# Altium project Main_PCB.PrjPcb
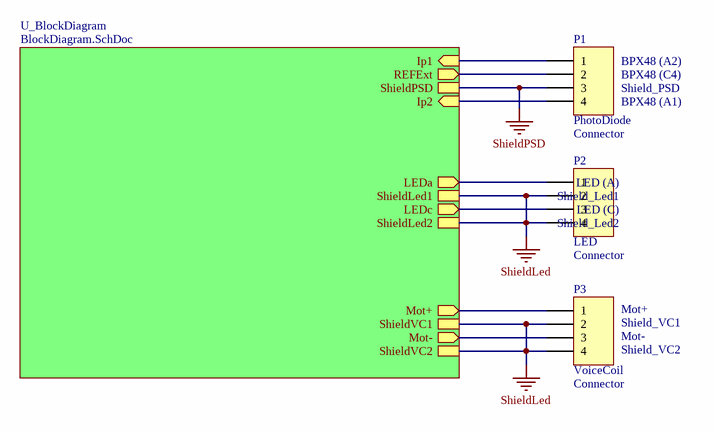
[diagram p0: Main_PCB.SchDoc]
ProjectVersionForDoc: 1_0_0; ProjectVersion: 1.0.0; ProjectNumber: N° SGX; ProjectiAiTitle: Balance; ProjectAuthor: BKO + PKI
8 sheets, 240 parts. Net scope: hierarchical (ports join the sheet entries above them; power ports are global).
Board file: iAi_TemplateProject_4L.PcbDoc
Sheets:
  Main_PCB.SchDoc
    U_BlockDiagram = BlockDiagram.SchDoc
      U_BlockPowerSupply = BlockPowerSupply.SchDoc
      U_BlockAmpli_LED = BlockAmpli_LED.SchDoc
      U_BlockAmpli_Mot = BlockAmpli_Mot.SchDoc
      U_BlockMesIp = BlockMesIp.SchDoc
      U_BlockUIAffichage = BlockUIAffichage.SchDoc
      U_BlockController = BlockController.SchDoc

## Sheet Main_PCB.SchDoc: Main_PCB
size A4; Author: BKO + PKI; Organization: Institut d'Automatisation Industrielle; SheetNumber: 1; SheetTotal: 8; SVN: OUI; Version: 1.0.0; NoProject: N° SGX; ProjectTitle: Balance; CurrentTime: 6; CurrentDate: 5; DocumentFullPathAndName: 8; DocumentName: 9; ModifiedDate: 13; ProjectName: <projet>

### Parts
P1  PhotoDiode  System: Connector  [HDR1X4]
P2  LED  System: Connector  [HDR1X4]
P3  VoiceCoil  System: Connector  [HDR1X4]

### Sub-sheets
U_BlockDiagram = BlockDiagram.SchDoc: Ip1 (in), REFExt (out), LEDa (out), LEDc (out), Mot+ (out), Mot- (out), ShieldPSD, Ip2 (in), ShieldLed1, ShieldLed2, ShieldVC1, ShieldVC2

### Nets
ShieldLed: P1.3 P2.2 P2.4 P3.2 P3.4 ; sheet U_BlockDiagram/ShieldPSD, sheet U_BlockDiagram/ShieldLed1, sheet U_BlockDiagram/ShieldLed2, sheet U_BlockDiagram/ShieldVC1, sheet U_BlockDiagram/ShieldVC2  [also labelled ShieldPSD]  [project net Shield]
NetP1_1: P1.1 ; sheet U_BlockDiagram/Ip1
NetP1_2: P1.2 ; sheet U_BlockDiagram/REFExt
NetP1_4: P1.4 ; sheet U_BlockDiagram/Ip2
NetP2_1: P2.1 ; sheet U_BlockDiagram/LEDa
NetP2_3: P2.3 ; sheet U_BlockDiagram/LEDc
NetP3_1: P3.1 ; sheet U_BlockDiagram/Mot+
NetP3_3: P3.3 ; sheet U_BlockDiagram/Mot-

### Notes on the sheet
- (near P1) BPX48 (A2)
- (near P1) BPX48 (C4)
- (near P1) Shield_PSD
- (near P1) BPX48 (A1)
- (near P2) LED (C)
- (near P2) Shield_Led1
- (near P2) LED (A)
- (near P2) Shield_Led2
- (near P3) Mot+
- (near P3) Mot-
- (near P3) Shield_VC1
- (near P3) Shield_VC2
- Title
- Institut d'automatisation industrielle
  rte de Cheseaux 1
  CH-1401 Yverdon-les-Bains
  T +41(0)24 55 77 377    F +41(0)24 55 76 320
  http://iai.heig-vd.ch       iai@heig-vd.ch
- Date:
- Size:
- A4
- Project:
- Sheet
- of
- No.
- Author:
- SVN
- Version
- File:

### Library data of the parts
P1-P3 = Header 4: LatestRevisionDate: 17-Jul-2002; LatestRevisionNote: Re-released for DXP Platform.; Publisher: Altium Limited

## Sheet BlockDiagram.SchDoc: <title>
size A4; Author: BKO + PKI; Organization: Institut d'Automatisation Industrielle; SheetNumber: 2; SheetTotal: 8; SVN: OUI; Version: 1.0.0; NoProject: N° SGX; ProjectTitle: Balance; CurrentTime: 6; CurrentDate: 5; DocumentFullPathAndName: 8; DocumentName: 9; ModifiedDate: 13; ProjectName: <projet>
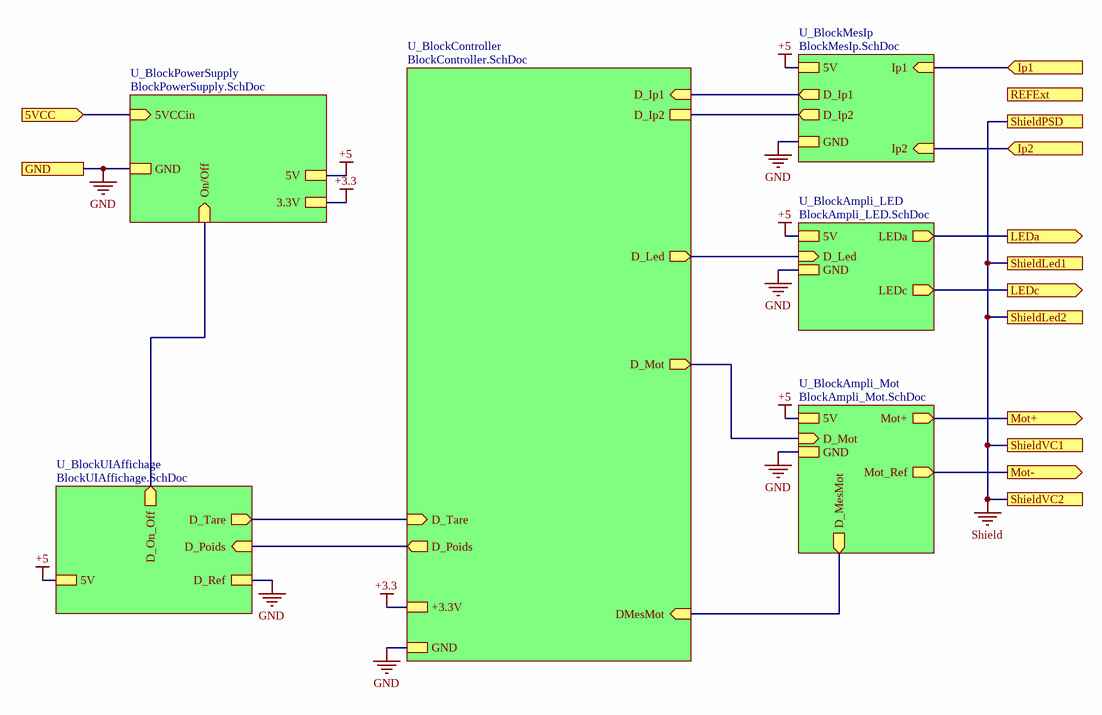
[diagram p1: BlockDiagram.SchDoc]

### Sub-sheets
U_BlockAmpli_LED = BlockAmpli_LED.SchDoc: LEDa (out), LEDc (out), D_Led (in), GND, 5V
U_BlockAmpli_Mot = BlockAmpli_Mot.SchDoc: Mot+ (out), Mot_Ref (out), D_Mot (in), GND, 5V, D_MesMot (out)
U_BlockController = BlockController.SchDoc: D_Ip1 (in), D_Ip2, D_Led (out), D_Mot (out), DMesMot (in), D_Tare (in), GND, +3.3V, D_Poids (out)
U_BlockMesIp = BlockMesIp.SchDoc: Ip1 (in), Ip2 (in), D_Ip1 (out), D_Ip2 (out), GND, 5V
U_BlockPowerSupply = BlockPowerSupply.SchDoc: 5V, GND, 5VCCin (in), On/Off (in), 3.3V
U_BlockUIAffichage = BlockUIAffichage.SchDoc: D_Ref, D_Tare (out), D_On_Off (out), 5V, D_Poids (in)

### Ports
5VCC (in), GND, Ip1 (in), Ip2 (in), LEDa (out), LEDc (out), Mot+ (out), Mot- (out), REFExt (out), ShieldLed1, ShieldLed2, ShieldPSD, ShieldVC1, ShieldVC2

### Nets
+3.3: sheet U_BlockPowerSupply/3.3V, sheet U_BlockController/+3.3V
+5: sheet U_BlockPowerSupply/5V, sheet U_BlockAmpli_LED/5V, sheet U_BlockAmpli_Mot/5V, sheet U_BlockMesIp/5V, sheet U_BlockUIAffichage/5V
GND: port GND, sheet U_BlockPowerSupply/GND, sheet U_BlockAmpli_LED/GND, sheet U_BlockAmpli_Mot/GND, sheet U_BlockMesIp/GND, sheet U_BlockUIAffichage/D_Ref, sheet U_BlockController/GND
Shield: port ShieldPSD, port ShieldLed1, port ShieldLed2, port ShieldVC1, port ShieldVC2
NetP1_1: port Ip1, sheet U_BlockMesIp/Ip1
NetP1_4: port Ip2, sheet U_BlockMesIp/Ip2
NetP2_1: port LEDa, sheet U_BlockAmpli_LED/LEDa
NetP2_3: port LEDc, sheet U_BlockAmpli_LED/LEDc
NetP3_1: port Mot+, sheet U_BlockAmpli_Mot/Mot+
NetP3_3: port Mot-, sheet U_BlockAmpli_Mot/Mot_Ref
(unnamed): port 5VCC, sheet U_BlockPowerSupply/5VCCin
(unnamed): sheet U_BlockPowerSupply/On/Off, sheet U_BlockUIAffichage/D_On_Off
(unnamed): sheet U_BlockAmpli_LED/D_Led, sheet U_BlockController/D_Led
(unnamed): sheet U_BlockAmpli_Mot/D_Mot, sheet U_BlockController/D_Mot
(unnamed): sheet U_BlockAmpli_Mot/D_MesMot, sheet U_BlockController/DMesMot
(unnamed): sheet U_BlockMesIp/D_Ip1, sheet U_BlockController/D_Ip1
(unnamed): sheet U_BlockMesIp/D_Ip2, sheet U_BlockController/D_Ip2
(unnamed): sheet U_BlockUIAffichage/D_Tare, sheet U_BlockController/D_Tare
(unnamed): sheet U_BlockUIAffichage/D_Poids, sheet U_BlockController/D_Poids

### Notes on the sheet
- Title
- Institut d'automatisation industrielle
  rte de Cheseaux 1
  CH-1401 Yverdon-les-Bains
  T +41(0)24 55 77 377    F +41(0)24 55 76 320
  http://iai.heig-vd.ch       iai@heig-vd.ch
- Date:
- Size:
- A4
- Project:
- Sheet
- of
- No.
- Author:
- SVN
- Version
- File:

## Sheet BlockPowerSupply.SchDoc: Block_PowerSupply
size A3; Author: BKO + PKI; Organization: Institut d'Automatisation Industrielle; SheetNumber: 3; SheetTotal: 8; SVN: OUI; Version: 1.0.0; NoProject: N° SGX; ProjectTitle: Balance; CurrentTime: 6; CurrentDate: 5; DocumentFullPathAndName: 8; DocumentName: 9; ModifiedDate: 13; ProjectName: <projet>
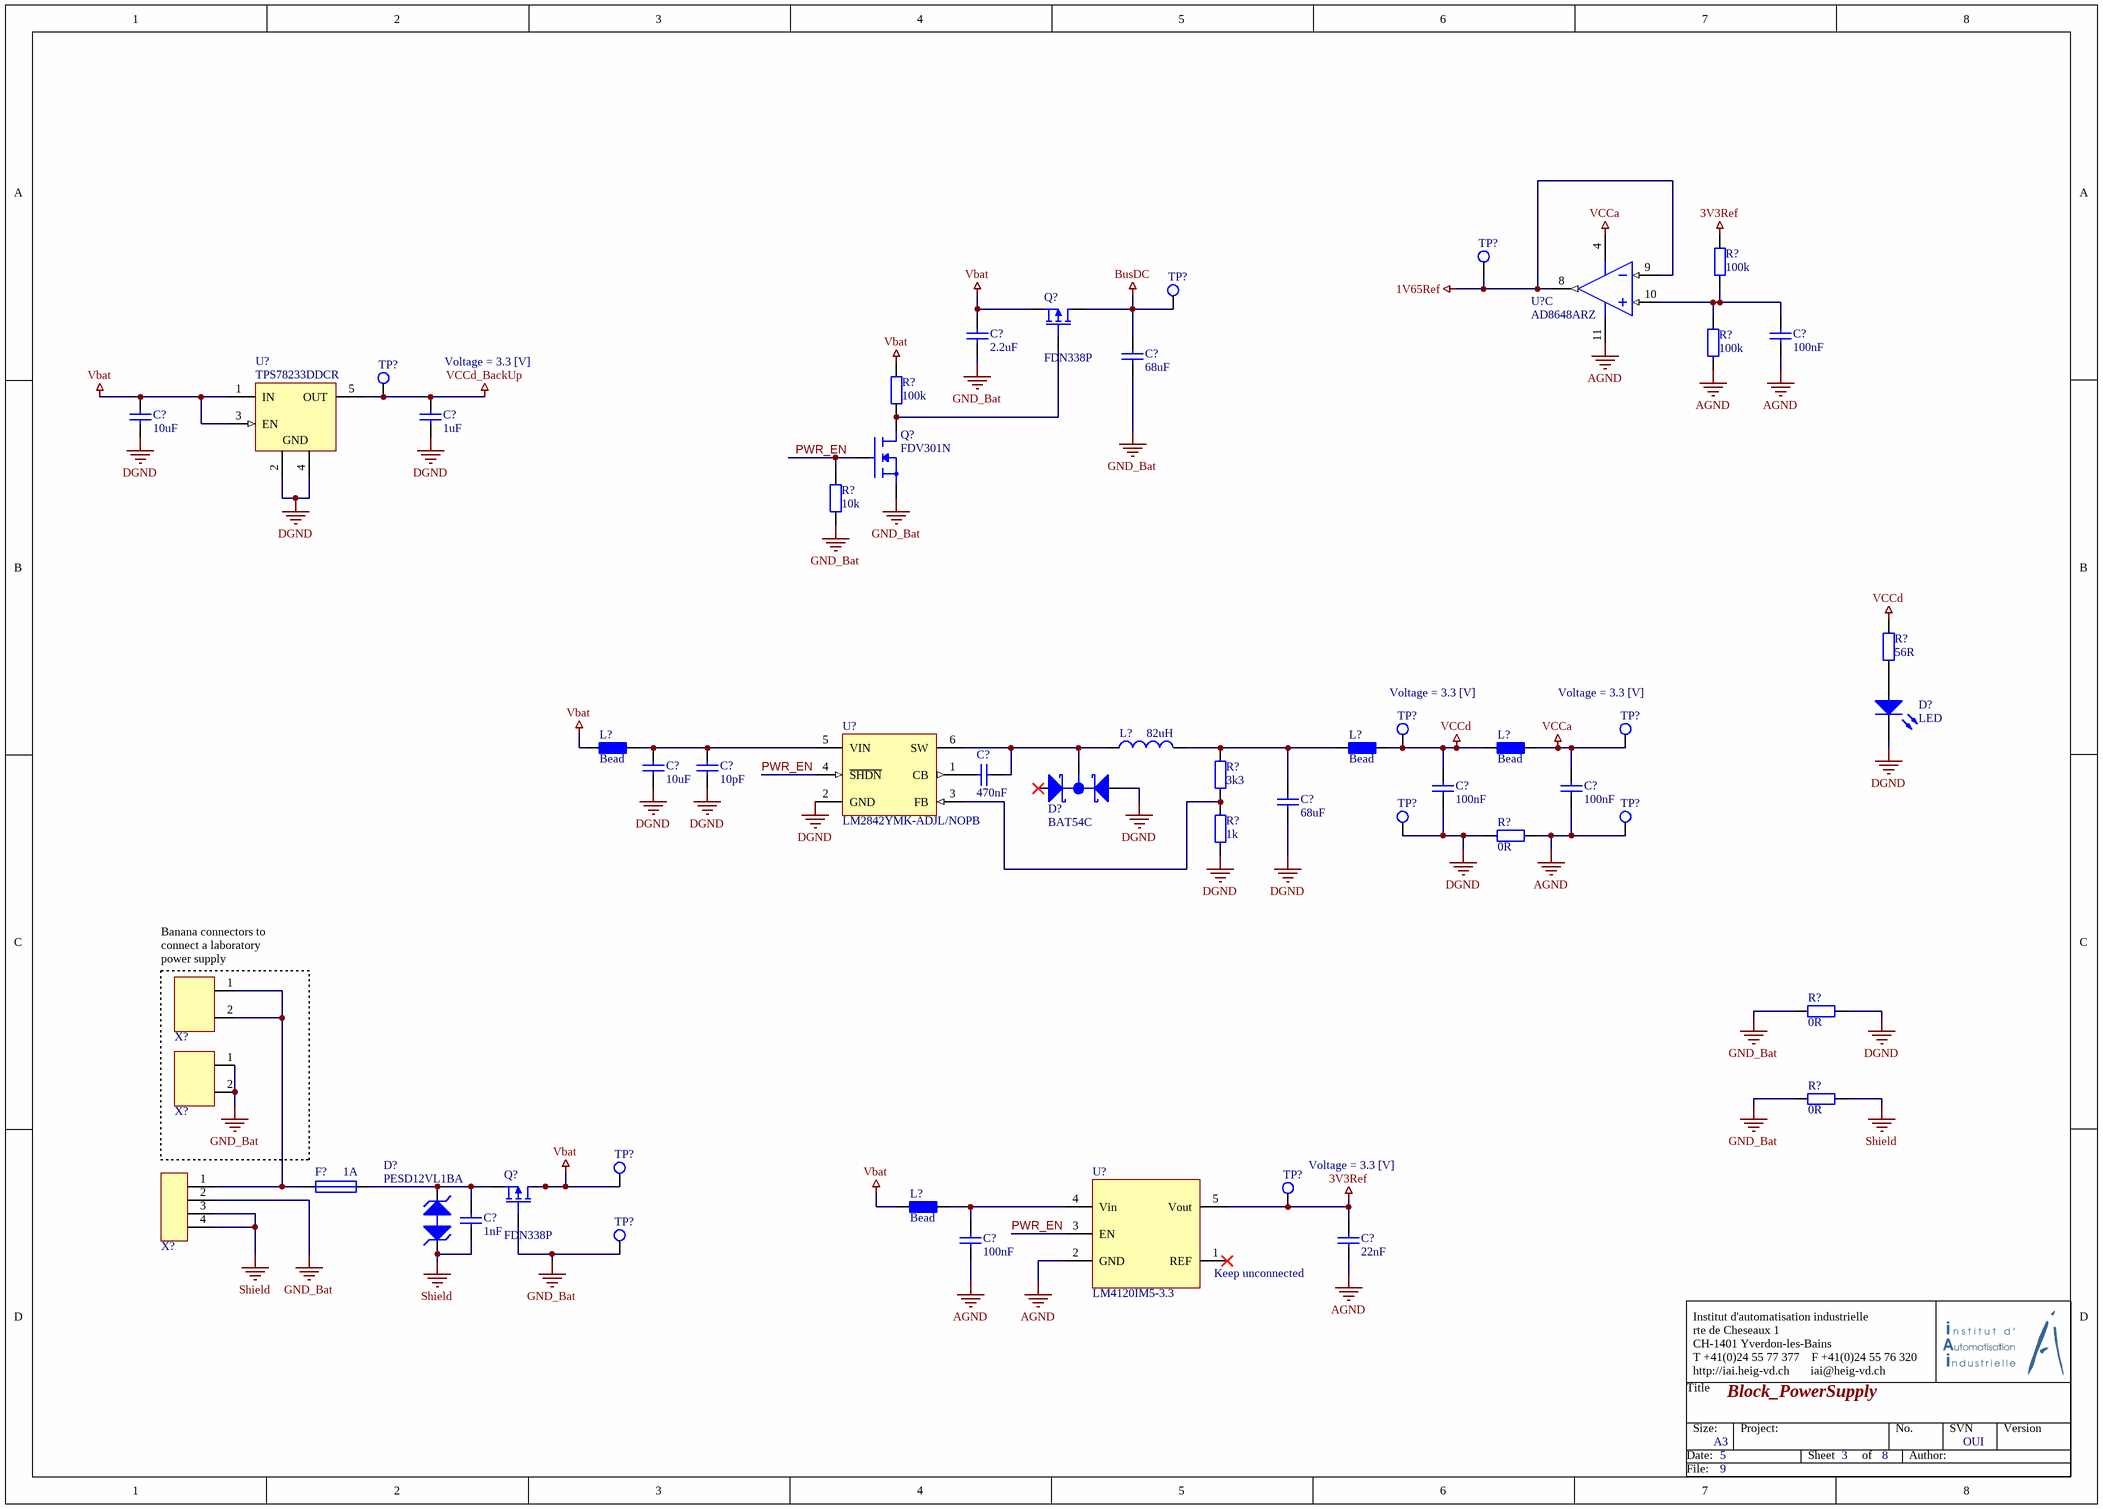
[diagram p2: BlockPowerSupply.SchDoc]

### Parts
(Parts that share a designator on the sheet are numbered #1, #2 ... from top to bottom, then left to right.)
C?#1  2.2uF  [CAPC2012N]
C?#2  100nF  [CAPC2012N]
C?#3  68uF  [CAP1206]
C?#4  10uF  [CAP1206]
C?#5  1uF  [CAPC2012N]
C?#6  470nF  [CAPC2012N]
C?#7  10uF  [CAP1206]
C?#8  10pF  [CAPC2012N]
C?#9  100nF  [CAPC2012N]
C?#10  100nF  [CAPC2012N]
C?#11  68uF  [CAP1206]
C?#12  1nF  [CAPC2012N]
C?#13  100nF  [CAPC2012N]
C?#14  22nF  [CAPC2012N]
D?#1  LED  [LED2012N]
D?#2  BAT54C  [SOT23-3N]
D?#3  PESD12VL1BA  [SOD323]
F?  1A  [RESC2012N]
L?#1  Bead  [RESC2012N]
L?#2  82uH  [SRR1260A-820MC]
L?#3  Bead  [RESC2012N]
L?#4  Bead  [RESC2012N]
L?#5  Bead  [RESC2012N]
Q?#1  FDN338P  [SOT23-3N]
Q?#2  FDV301N  [SOT23-3N]
Q?#3  FDN338P  [SOT23-3N]
R?#1  100k  [RESC2012N]
R?#2  100k  [RESC2012N]
R?#3  100k  [RESC2012N]
R?#4  10k  [RESC2012N]
R?#5  56R  [RESC2012N]
R?#6  3k3  [RESC2012N]
R?#7  1k  [RESC2012N]
R?#8  0R  [RESC2012N]
R?#9  0R  [RESC2012N]
R?#10  0R  [RESC2012N]
TP?#1  TP  [Testpoint]  (value not drawn)
TP?#2  TP  [Testpoint]  (value not drawn)
TP?#3  TP  [Testpoint]  (value not drawn)
TP?#4  TP  [Testpoint]  (value not drawn)
TP?#5  TP  [Testpoint]  (value not drawn)
TP?#6  TP  [Testpoint]  (value not drawn)
TP?#7  TP  [Testpoint]  (value not drawn)
TP?#8  TP  [Testpoint]  (value not drawn)
TP?#9  TP  [Testpoint]  (value not drawn)
TP?#10  TP  [Testpoint]  (value not drawn)
U?#1  AD8648ARZ  [ADI-R-14_M]  (part C of 4)
U?#2  TPS78233DDCR  [SOT-23-5]
U?#3  LM2842YMK-ADJL/NOPB  [SOT-23-6]
U?#4  LM4120IM5-3.3  [SOT-23-5]
X?#1  Fiche Banane Rouge 4mm  [BANANE]  (value not drawn)
X?#2  Fiche Banane Noire 4mm  [BANANE]  (value not drawn)
X?#3  MicroMatch4p  [MicroMatch4p]  (value not drawn)

### Nets
1V65Ref: TP?#1.1 U?#1.8(OUT_C) U?#1.9(-IN_C)
3V3Ref: C?#14.2 R?#1.2 TP?#9.1 U?#4.5(Vout)
AGND: C?#2.1 C?#10.1 C?#13.1 C?#14.1 R?#2.1 R?#8.2 TP?#7.1 U?#1.11(-V) U?#4.2(GND)
BusDC: C?#3.2 Q?#1.3(D) TP?#2.1
DGND: C?#4.1 C?#5.1 C?#7.1 C?#8.1 C?#9.1 C?#11.1 D?#1.2(K) D?#2.2(A2) R?#7.2 R?#8.1 R?#9.2 TP?#6.1 U?#2.2(GND) U?#2.4(GND) U?#3.2(GND)
GND_Bat: C?#1.1 C?#3.1 Q?#2.2(S) Q?#3.1(G) R?#4.1 R?#9.1 R?#10.1 TP?#10.1 X?#2.1 X?#2.2 X?#3.2
Shield: C?#12.1 D?#3.1(K1) R?#10.2 X?#3.3 X?#3.4
Vbat: C?#1.2 C?#4.2 L?#1.1 L?#5.1 Q?#1.2(S) Q?#3.3(D) R?#3.2 TP?#8.1 U?#2.1(IN) U?#2.3(EN)
VCCa: C?#10.2 L?#4.2 TP?#5.1 U?#1.4(+V)
VCCd: C?#9.2 L?#3.2 L?#4.1 R?#5.2 TP?#4.1
VCCd_BackUp: C?#5.2 TP?#3.1 U?#2.5(OUT)
PWR_EN: Q?#2.1(G) R?#4.2 U?#3.4(~{SHDN}) U?#4.3(EN)
NetC?#2_2: C?#2.2 R?#1.1 R?#2.2 U?#1.10(+IN_C)
NetC?#6_1: C?#6.1 U?#3.1(CB)
NetC?#6_2: C?#6.2 D?#2.3(K) L?#2.1 U?#3.6(SW)
NetC?#7_2: C?#7.2 C?#8.2 L?#1.2 U?#3.5(VIN)
NetC?#11_2: C?#11.2 L?#2.2 L?#3.1 R?#6.2
NetC?#12_2: C?#12.2 D?#3.2(K2) F?.2 Q?#3.2(S)
NetC?#13_2: C?#13.2 L?#5.2 U?#4.4(Vin)
NetD?#1_1: D?#1.1(A) R?#5.1
NetF?_1: F?.1 X?#1.1 X?#1.2 X?#3.1
NetQ?#1_1: Q?#1.1(G) Q?#2.3(D) R?#3.1
NetR?#6_1: R?#6.1 R?#7.1 U?#3.3(FB)

Not connected (* = marked no-connect by the designer): D?#2 1(A1)*; U?#4 1(REF)*

### Notes on the sheet
- Voltage = 3.3 [V]
- (near TP?#5) Voltage = 3.3 [V]
- (near X?#1) Banana connectors to connect a laboratory power supply
- (near TP?#9) Voltage = 3.3 [V]
- (near U?#4) Keep unconnected
- Title
- Institut d'automatisation industrielle
  rte de Cheseaux 1
  CH-1401 Yverdon-les-Bains
  T +41(0)24 55 77 377    F +41(0)24 55 76 320
  http://iai.heig-vd.ch       iai@heig-vd.ch
- Date:
- Size:
- A3
- Project:
- Sheet
- of
- No.
- Author:
- SVN
- Version
- File:

### Library data of the parts
C?#1 = Cap_2.2uF: Capacitor; Value: 2.2uF; Supplier 1: Digi-Key; Supplier Part Number 1: 490-10744-1-ND
C?#2 C?#9 C?#10 C?#13 = Cap_100nF: Capacitor; Value: 100nF; Supplier 1: Digi-Key; Supplier Part Number 1: 478-1395-1-ND
C?#3 C?#11 = Cap_68uF: Capacitor; Value: 68uF; Supplier 1: Digi-Key; Supplier Part Number 1: 445-11687-1-ND
C?#4 C?#7 = Cap_10uF: Capacitor; Value: 10uF; Supplier 1: Digi-Key; Supplier Part Number 1: 445-7886-1-ND
C?#5 = Cap_1uF: Capacitor; Value: 1uF; Supplier 1: Digi-Key; Supplier Part Number 1: 490-10743-1-ND
C?#6 = Cap_470nF: Capacitor; Value: 470nF; Supplier 1: Digi-Key; Supplier Part Number 1: 399-8100-1-ND
C?#8 = Cap_10pF: Capacitor; Value: 10pF; Supplier 1: Digi-Key; Supplier Part Number 1: 311-1099-1-ND
C?#12 = Cap_1nF: Capacitor; Value: 1nF; Supplier 1: Digi-Key; Supplier Part Number 1: 311-1127-1-ND
C?#14 = Cap_22nF: Capacitor; Value: 22nF; Supplier 1: Digi-Key; Supplier Part Number 1: 311-1138-1-ND
D?#1 = LED_Green_0805: Supplier 1: Digi-Key; Supplier Part Number 1: 475-1410-1-ND
F? = Fuse_1A: MFU0805FF01000P100; Supplier 1: Digi-Key; Supplier Part Number 1: MFU08051.00CT-ND; Value: 1A
L?#2 = SRR1260A-820M: Value: 82uH; Supplier 1: Digi-Key; Supplier Part Number 1: SRR1260A-820MCT-ND
Q?#1 Q?#3 = FDN338P: MOSFet P; Supplier 1: Digi-Key; Supplier Part Number 1: FDN338PCT-ND; Value: FDN338P
R?#1-R?#3 = Res_100k: Resistor; Value: 100k; Supplier 1: Digi-Key; Supplier Part Number 1: 311-100KCRCT-ND
R?#4 = Res_10k: Resistor; Value: 10k; Supplier 1: Digi-Key; Supplier Part Number 1: 311-10.0KCRCT-ND
R?#5 = Res_56R: Resistor; Value: 56R; Supplier 1: Digi-Key; Supplier Part Number 1: 311-56.0CRCT-ND
R?#6 = Res_3k3: Resistor; Value: 3k3; Supplier 1: Digi-Key; Supplier Part Number 1: 311-3.30KCRCT-ND
R?#7 = Res_1k: Resistor; Value: 1k; Supplier 1: Digi-Key; Supplier Part Number 1: 311-1.00KCRCT-ND
R?#8-R?#10 = Res_0R: Resistor; Value: 0R; Supplier 1: Digi-Key; Supplier Part Number 1: 311-0.0ARCT-ND
TP?#1-TP?#10 = TP: =Value; Supplier 1: Digi-Key; Supplier Part Number 1: 36-5006-ND
U?#1 = AD8648ARZ: Quad Channel Wide Bandwidth Operational Amplifier, 22 MHz BW, 12 V/us SR, Industrial, 14-pin SOIC (R-14), Tube; Generic Part Number: AD8648; Manufacturer: Analog Devices; Amplifiers Per Package: 4; Automotive Qualified: Yes; Input Bias Current: 200fA; Input Offset Voltage: 700uV; Iq/Amp: 2mA; Slew Rate: 12V/us; Small Signal Bandwidth: 22MHz; V Span Max: 5.5V; V Span Min: 2.7V; DatasheetVersion: Rev. D; PackageVersion: 060606-A; PackageReference: R-14; PackageDescription: 14-Pin Standard Small Outline Package, Body 8.65 x 3.9 mm, Pitch 1.27 mm; Mounting Technology: Surface Mount; Code_JEDEC: MS-012-AB; PartNumber: AD8648ARZ; ComponentLink1Description: Manufacturer URL; ComponentLink1URL: http://www.analog.com/en/index.html; ComponentLink2Description: Datasheet; ComponentLink2URL: http://www.analog.com/static/imported-files/data_sheets/AD8646_8647_8648.pdf; ComponentLink3Description: Package Specification; ComponentLink3URL: http://www.analog.com/static/imported-files/packages/PKG_PDF/SOIC_Narrow%20(R)/R_14.pdf; Supplier 1: Digi-Key; Supplier Part Number 1: AD8648ARZ-ND
U?#2 = TPS78233DDCR: Single Output LDO, 150 mA, Fixed 3.3 V Output, 2.2 to 5.5 V Input, with 0.5 uA Quiescent Current, 5-pin SOT (DDC), -40 to 125 degC, Green (RoHS & no Sb/Br); Manufacturer: Texas Instruments; Accuracy(%): 3; Dynamic Voltage Scaling: TRUE; Fixed Output Options(V): 3.3; Iout(Max)(A): 0.15; Iq(Typ)(mA): 0.0005; Rating: Catalog; SubFamily: Single Channel LDO; Vdo(Typ)(mV): 130; Vin(Max)(V): 5.5; Vin(Min)(V): 2.2; DatasheetVersion: SBVS115B; PackageVersion: 4204403-2/E; PackageReference: DDC5; PackageDescription: 5-Pin Plastic Small Outline, Body 2.9 x 1.6 mm, 0.95 mm Pitch; Supplier 1: Digi-Key; Supplier Part Number 1: 296-24059-1-ND; Eco-Plan: Green (RoHS & no Sb/Br); Vout Adj(Max)(V): 3.3; Vout Adj(Min)(V): 3.3; Mounting Technology: Surface Mount; Code_JEDEC: MO-193; PartNumber: TPS78233DDCR; ComponentLink1Description: Manufacturer URL; ComponentLink1URL: http://www.ti.com/; ComponentLink2Description: Datasheet; ComponentLink2URL: http://www.ti.com/general/docs/lit/getliterature.tsp?genericPartNumber=TPS78233&fileType=pdf; ComponentLink3Description: Package Specification; ComponentLink3URL: http://www.ti.com/litv/pdf/mpds123d
U?#3 = LM2842YMK-ADJL/NOPB: 600 mA up to 42V Input Step-Down DC/DC Regulator, Thin 6-pin SOT23, Pb-Free, 1000 Reel; Supplier 1: Digi-Key; Supplier Part Number 1: LM2842YMK-ADJL/NOPBCT-ND
D?#2 = BAT54C: Supplier 1: Digi-Key; Supplier Part Number 1: BAT54CLT1GOSCT-ND
D?#3 = PESD12VL1BA: Supplier 1: Digi-Key; Supplier Part Number 1: 568-4022-1-ND
L?#1 L?#3-L?#5 = Bead: Value: Bead; Supplier 1: Digi-Key; Supplier Part Number 1: 240-2399-1-ND
Q?#2 = FDV301N: Value: FDV301N; Supplier 1: Digi-Key; Supplier Part Number 1: FDV301NCT-ND
U?#4 = LM4120IM5-3.3: Supplier 1: Digi-Key; Supplier Part Number 1: LM4120IM5-3.3/NOPBCT-ND
X?#1 = Fiche Banane Rouge 4mm: Supplier 1: Farnell; Supplier Part Number 1: 1698982
X?#2 = Fiche Banane Noire 4mm: Supplier 1: Farnell; Supplier Part Number 1: 1698983
X?#3 = MicroMatch4p: Supplier 1: Digi-Key; Supplier Part Number 1: A107022CT-ND

## Sheet BlockAmpli_LED.SchDoc: <title>
size A4; Author: BKO + PKI; Organization: Institut d'Automatisation Industrielle; SheetNumber: 5; SheetTotal: 8; SVN: OUI; Version: 1.0.0; NoProject: N° SGX; ProjectTitle: Balance; CurrentTime: 6; CurrentDate: 5; DocumentFullPathAndName: 8; DocumentName: 9; ModifiedDate: 13; ProjectName: <projet>
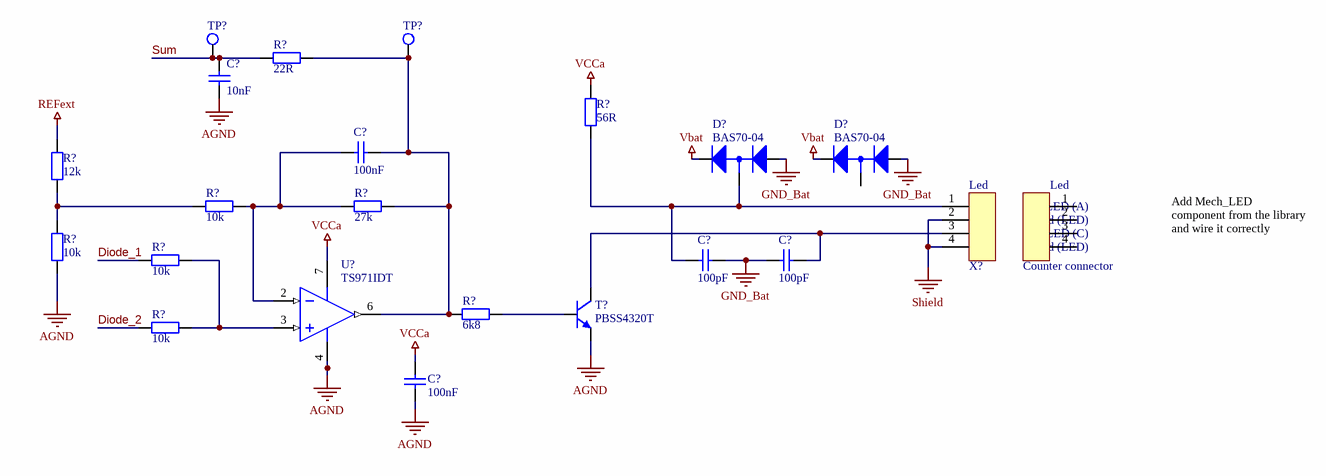
[diagram p3: BlockAmpli_LED.SchDoc]

### Parts
(Parts that share a designator on the sheet are numbered #1, #2 ... from top to bottom, then left to right.)
C?#15  10nF  [CAPC2012N]
C?#16  100nF  [CAPC2012N]
C?#17  100pF  [CAPC2012N]
C?#18  100pF  [CAPC2012N]
C?#19  100nF  [CAPC2012N]
D?#4  BAS70-04  [SOT23-3N]
D?#5  BAS70-04  [SOT23-3N]
R?#11  22R  [RESC2012N]
R?#12  56R  [RESC2012N]
R?#13  12k  [RESC2012N]
R?#14  10k  [RESC2012N]
R?#15  27k  [RESC2012N]
R?#16  10k  [RESC2012N]
R?#17  10k  [RESC2012N]
R?#18  6k8  [RESC2012N]
R?#19  10k  [RESC2012N]
T?  PBSS4320T  [SOT23-3N]
TP?#11  TP  [Testpoint]  (value not drawn)
TP?#12  TP  [Testpoint]  (value not drawn)
U?#5  TS971IDT  [SOIC8]
X?#4  MicroMatch4p  [MicroMatch4p]  (value not drawn)
Y?#1  Counter connector  (no BOM)

### Nets
AGND: C?#15.1 C?#19.1 R?#17.1 T?.2(E) U?#5.4(V-)
GND_Bat: C?#17.2 C?#18.1 D?#4.1(A) D?#5.1(A)
REFext: R?#13.2
Shield: X?#4.2 X?#4.4
Vbat: D?#4.2(K) D?#5.2(K)
VCCa: C?#19.2 R?#12.2 U?#5.7(V+)
Diode_1: R?#16.1
Diode_2: R?#19.1
Sum: C?#15.2 R?#11.1 TP?#11.1
NetC?#16_1: C?#16.1 R?#14.2 R?#15.1 U?#5.2(IN-)
NetC?#16_2: C?#16.2 R?#11.2 R?#15.2 R?#18.1 TP?#12.1 U?#5.6(OUT)
NetC?#17_1: C?#17.1 D?#4.3(A/K) R?#12.1 X?#4.1
NetC?#18_2: C?#18.2 T?.3(C) X?#4.3
NetR?#13_1: R?#13.1 R?#14.1 R?#17.2
NetR?#16_2: R?#16.2 R?#19.2 U?#5.3(IN+)
NetR?#18_2: R?#18.2 T?.1(B)

Not connected (* = marked no-connect by the designer): D?#5 3(A/K); Y?#1 1 2 3 4

### Notes on the sheet
- (near X?#4) Led
- (near Y?#1) Led
- (near Y?#1) LED (C)
- (near Y?#1) Shield (LED)
- (near Y?#1) LED (A)
- Add Mech_LED component from the library and wire it correctly
- Title
- Institut d'automatisation industrielle
  rte de Cheseaux 1
  CH-1401 Yverdon-les-Bains
  T +41(0)24 55 77 377    F +41(0)24 55 76 320
  http://iai.heig-vd.ch       iai@heig-vd.ch
- Date:
- Size:
- A4
- Project:
- Sheet
- of
- No.
- Author:
- SVN
- Version
- File:

### Library data of the parts
C?#15 = Cap_10nF: Capacitor; Value: 10nF; Supplier 1: Digi-Key; Supplier Part Number 1: 311-1136-1-ND
C?#16 C?#19 = Cap_100nF: Capacitor; Value: 100nF; Supplier 1: Digi-Key; Supplier Part Number 1: 478-1395-1-ND
C?#17 C?#18 = Cap_100pF: Capacitor; Value: 100pF; Supplier 1: Digi-Key; Supplier Part Number 1: 399-1122-1-ND
R?#11 = Res_22R: Resistor; Value: 22R; Supplier 1: Digi-Key; Supplier Part Number 1: 311-22.0CRCT-ND
R?#12 = Res_56R: Resistor; Value: 56R; Supplier 1: Digi-Key; Supplier Part Number 1: 311-56.0CRCT-ND
R?#13 = Res_12k: Resistor; Value: 12k; Supplier 1: Digi-Key; Supplier Part Number 1: 311-12.0KCRCT-ND
R?#14 R?#16 R?#17 R?#19 = Res_10k: Resistor; Value: 10k; Supplier 1: Digi-Key; Supplier Part Number 1: 311-10.0KCRCT-ND
R?#15 = Res_27k: Resistor; Value: 27k; Supplier 1: Digi-Key; Supplier Part Number 1: 311-27.0KCRCT-ND
R?#18 = Res_6k8: Resistor; Value: 6k8; Supplier 1: Digi-Key; Supplier Part Number 1: 311-6.80KCRCT-ND
TP?#11 TP?#12 = TP: =Value; Supplier 1: Digi-Key; Supplier Part Number 1: 36-5006-ND
Y?#1 = MicroMatch4p_Header: Counter connector of MicroMatch4p; Supplier 1: Digi-Key; Supplier Part Number 1: A107022CT-ND
D?#4 D?#5 = BAS70-04: Supplier 1: Digi-Key; Supplier Part Number 1: BAS70-04-FDICT-ND
T? = PBSS4320T: Supplier 1: Digi-Key; Supplier Part Number 1: 568-4157-1-ND
U?#5 = TS971IDT: Supplier 1: Digi-Key; Supplier Part Number 1: 497-6780-1-ND
X?#4 = MicroMatch4p: Supplier 1: Digi-Key; Supplier Part Number 1: A107022CT-ND

## Sheet BlockAmpli_Mot.SchDoc: Block_Ampli_Moteur
size A3; Author: BKO + PKI; Organization: Institut d'Automatisation Industrielle; SheetNumber: 7; SheetTotal: 8; SVN: OUI; Version: 1.0.0; NoProject: N° SGX; ProjectTitle: Balance; CurrentTime: 6; CurrentDate: 5; DocumentFullPathAndName: 8; DocumentName: 9; ModifiedDate: 13; ProjectName: <projet>
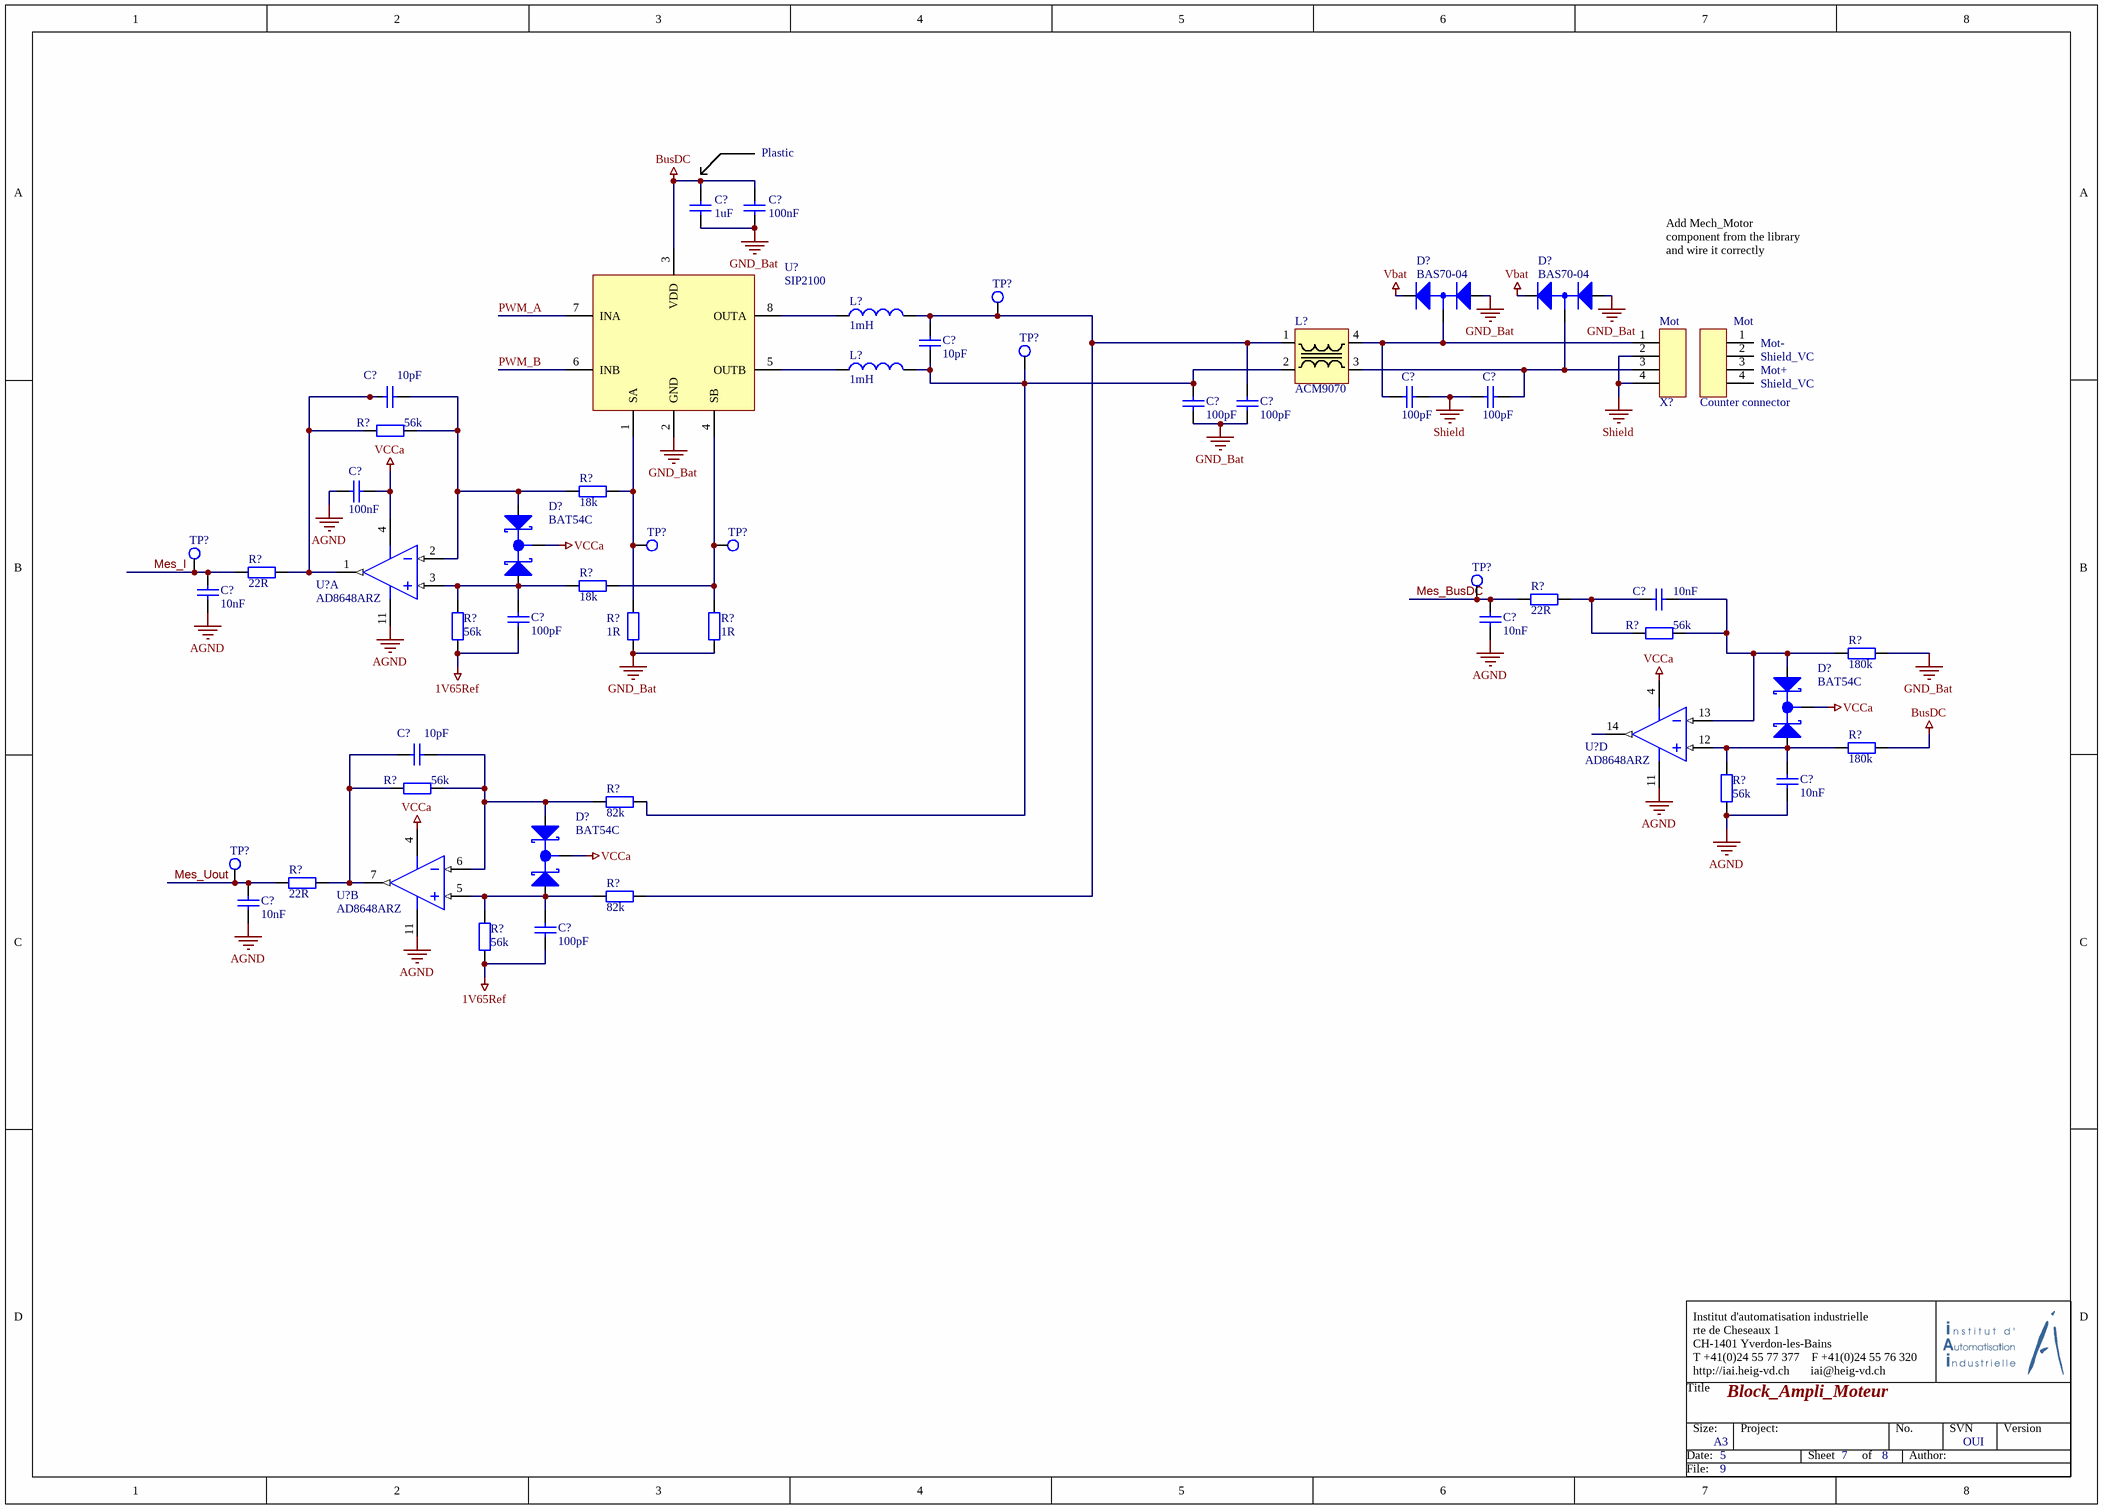
[diagram p4: BlockAmpli_Mot.SchDoc]

### Parts
(Parts that share a designator on the sheet are numbered #1, #2 ... from top to bottom, then left to right.)
C?#20  1uF  [CAP2824]
C?#21  100nF  [CAPC2012N]
C?#22  10pF  [CAPC2012N]
C?#23  10pF  [CAPC2012N]
C?#24  100pF  [CAPC2012N]
C?#25  100pF  [CAPC2012N]
C?#26  100pF  [CAPC2012N]
C?#27  100pF  [CAPC2012N]
C?#28  100nF  [CAPC2012N]
C?#29  10nF  [CAPC2012N]
C?#30  10nF  [CAPC2012N]
C?#31  100pF  [CAPC2012N]
C?#32  10nF  [CAPC2012N]
C?#33  10pF  [CAPC2012N]
C?#34  10nF  [CAPC2012N]
C?#35  10nF  [CAPC2012N]
C?#36  100pF  [CAPC2012N]
D?#6  BAS70-04  [SOT23-3N]
D?#7  BAS70-04  [SOT23-3N]
D?#8  BAT54C  [SOT23-3N]
D?#9  BAT54C  [SOT23-3N]
D?#10  BAT54C  [SOT23-3N]
L?#6  1mH  [B82477G4]
L?#7  ACM9070  [ACM9070]
L?#8  1mH  [B82477G4]
R?#20  56k  [RESC2012N]
R?#21  18k  [RESC2012N]
R?#22  22R  [RESC2012N]
R?#23  18k  [RESC2012N]
R?#24  22R  [RESC2012N]
R?#25  56k  [RESC2012N]
R?#26  56k  [RESC2012N]
R?#27  1R  [RESC2012N]
R?#28  1R  [RESC2012N]
R?#29  180k  [RESC2012N]
R?#30  180k  [RESC2012N]
R?#31  56k  [RESC2012N]
R?#32  82k  [RESC2012N]
R?#33  56k  [RESC2012N]
R?#34  22R  [RESC2012N]
R?#35  82k  [RESC2012N]
R?#36  56k  [RESC2012N]
TP?#13  TP  [Testpoint]  (value not drawn)
TP?#14  TP  [Testpoint]  (value not drawn)
TP?#15  TP  [Testpoint]  (value not drawn)
TP?#16  TP  [Testpoint]  (value not drawn)
TP?#17  TP  [Testpoint]  (value not drawn)
TP?#18  TP  [Testpoint]  (value not drawn)
TP?#19  TP  [Testpoint]  (value not drawn)
U?#6  SIP2100  [SOIC8]
U?#7  AD8648ARZ  [ADI-R-14_M]  (part A of 4)
U?#8  AD8648ARZ  [ADI-R-14_M]  (part D of 4)
U?#9  AD8648ARZ  [ADI-R-14_M]  (part B of 4)
X?#5  MicroMatch4p  [MicroMatch4p]  (value not drawn)
Y?#2  Counter connector  (no BOM)

### Nets
1V65Ref: C?#31.1 C?#36.1 R?#26.1 R?#36.1
AGND: C?#28.2 C?#29.1 C?#32.1 C?#34.1 C?#35.1 R?#33.1 U?#7.11(-V) U?#8.11(-V) U?#9.11(-V)
BusDC: C?#20.2 C?#21.2 R?#30.2 U?#6.3(VDD)
GND_Bat: C?#20.1 C?#21.1 C?#26.1 C?#27.1 D?#6.1(A) D?#7.1(A) R?#27.1 R?#28.1 R?#29.2 U?#6.2(GND)
Shield: C?#24.2 C?#25.1 X?#5.2 X?#5.4
Vbat: D?#6.2(K) D?#7.2(K)
VCCa: C?#28.1 D?#8.3(K) D?#9.3(K) D?#10.3(K) U?#7.4(+V) U?#8.4(+V) U?#9.4(+V)
Mes_BusDC: C?#32.2 R?#24.1 TP?#18.1
Mes_I: C?#29.2 R?#22.1 TP?#17.1
Mes_Uout: C?#35.2 R?#34.1 TP?#19.1
PWM_A: U?#6.7(INA)
PWM_B: U?#6.6(INB)
NetC?#22_1: C?#22.1 C?#26.2 L?#7.2 L?#8.2 R?#32.2 TP?#14.1
NetC?#22_2: C?#22.2 C?#27.2 L?#6.2 L?#7.1 R?#35.2 TP?#13.1
NetC?#23_1: C?#23.1 R?#20.1 R?#22.2 U?#7.1(OUT_A)
NetC?#23_2: C?#23.2 D?#8.1(A1) R?#20.2 R?#21.1 U?#7.2(-IN_A)
NetC?#24_1: C?#24.1 D?#6.3(A/K) L?#7.4 X?#5.1
NetC?#25_2: C?#25.2 D?#7.3(A/K) L?#7.3 X?#5.3
NetC?#30_1: C?#30.1 D?#9.1(A1) R?#25.2 R?#29.1 U?#8.13(-IN_D)
NetC?#30_2: C?#30.2 R?#24.2 R?#25.1
NetC?#31_2: C?#31.2 D?#8.2(A2) R?#23.1 R?#26.2 U?#7.3(+IN_A)
NetC?#33_1: C?#33.1 R?#31.1 R?#34.2 U?#9.7(OUT_B)
NetC?#33_2: C?#33.2 D?#10.1(A1) R?#31.2 R?#32.1 U?#9.6(-IN_B)
NetC?#34_2: C?#34.2 D?#9.2(A2) R?#30.1 R?#33.2 U?#8.12(+IN_D)
NetC?#36_2: C?#36.2 D?#10.2(A2) R?#35.1 R?#36.2 U?#9.5(+IN_B)
NetL?#6_1: L?#6.1 U?#6.8(OUTA)
NetL?#8_1: L?#8.1 U?#6.5(OUTB)
NetR?#21_2: R?#21.2 R?#27.2 TP?#15.1 U?#6.1(SA)
NetR?#23_2: R?#23.2 R?#28.2 TP?#16.1 U?#6.4(SB)

Not connected (* = marked no-connect by the designer): U?#8 14(OUT_D); Y?#2 1 2 3 4

### Notes on the sheet
- (near C?#21) Plastic
- Add Mech_Motor component from the library and wire it correctly
- (near X?#5) Mot
- (near Y?#2) Mot
- (near Y?#2) Mot-
- (near Y?#2) Shield_VC
- (near Y?#2) Mot+
- Title
- Institut d'automatisation industrielle
  rte de Cheseaux 1
  CH-1401 Yverdon-les-Bains
  T +41(0)24 55 77 377    F +41(0)24 55 76 320
  http://iai.heig-vd.ch       iai@heig-vd.ch
- Date:
- Size:
- A3
- Project:
- Sheet
- of
- No.
- Author:
- SVN
- Version
- File:

### Library data of the parts
C?#20 = Cap_1uF_Plastic: Capacitor; Value: 1uF; Supplier 1: Digi-Key; Supplier Part Number 1: 399-6416-1-ND
C?#21 C?#28 = Cap_100nF: Capacitor; Value: 100nF; Supplier 1: Digi-Key; Supplier Part Number 1: 478-1395-1-ND
C?#22 C?#23 C?#33 = Cap_10pF: Capacitor; Value: 10pF; Supplier 1: Digi-Key; Supplier Part Number 1: 311-1099-1-ND
C?#24-C?#27 C?#31 C?#36 = Cap_100pF: Capacitor; Value: 100pF; Supplier 1: Digi-Key; Supplier Part Number 1: 399-1122-1-ND
C?#29 C?#30 C?#32 C?#34 C?#35 = Cap_10nF: Capacitor; Value: 10nF; Supplier 1: Digi-Key; Supplier Part Number 1: 311-1136-1-ND
L?#6 L?#8 = B82477G4105M: Supplier 1: Digi-Key; Supplier Part Number 1: 495-1820-1-ND; Value: 1mH
R?#20 R?#25 R?#26 R?#31 R?#33 R?#36 = Res_56k: Resistor; Value: 56k; Supplier 1: Digi-Key; Supplier Part Number 1: 311-56.0KCRCT-ND
R?#21 R?#23 = Res_18k: Resistor; Value: 18k; Supplier 1: Digi-Key; Supplier Part Number 1: 311-18.0KCRCT-ND
R?#22 R?#24 R?#34 = Res_22R: Resistor; Value: 22R; Supplier 1: Digi-Key; Supplier Part Number 1: 311-22.0CRCT-ND
R?#27 R?#28 = Res_1R: Resistor; Value: 1R; Supplier 1: Digi-Key; Supplier Part Number 1: CRT0805-CY-1R00ELFCT-ND
R?#29 R?#30 = Res_180k: Resistor; Value: 180k; Supplier 1: Digi-Key; Supplier Part Number 1: 311-180KCRCT-ND
R?#32 R?#35 = Res_82k: Resistor; Value: 82k; Supplier 1: Digi-Key; Supplier Part Number 1: 311-82.0KCRCT-ND
TP?#13-TP?#19 = TP: =Value; Supplier 1: Digi-Key; Supplier Part Number 1: 36-5006-ND
U?#7-U?#9 = AD8648ARZ: as U?#1 on sheet BlockPowerSupply; DatasheetVersion: Rev. D; PackageVersion: 060606-A; PackageReference: R-14; PackageDescription: 14-Pin Standard Small Outline Package, Body 8.65 x 3.9 mm, Pitch 1.27 mm; Mounting Technology: Surface Mount; Code_JEDEC: MS-012-AB; PartNumber: AD8648ARZ; ComponentLink1Description: Manufacturer URL; ComponentLink1URL: http://www.analog.com/en/index.html; ComponentLink2Description: Datasheet; ComponentLink2URL: http://www.analog.com/static/imported-files/data_sheets/AD8646_8647_8648.pdf; ComponentLink3Description: Package Specification; ComponentLink3URL: http://www.analog.com/static/imported-files/packages/PKG_PDF/SOIC_Narrow%20(R)/R_14.pdf; Supplier 1: Digi-Key; Supplier Part Number 1: AD8648ARZ-ND
Y?#2 = MicroMatch4p_Header: Counter connector of MicroMatch4p; Supplier 1: Digi-Key; Supplier Part Number 1: A107022CT-ND
D?#6 D?#7 = BAS70-04: Supplier 1: Digi-Key; Supplier Part Number 1: BAS70-04-FDICT-ND
D?#8-D?#10 = BAT54C: Supplier 1: Digi-Key; Supplier Part Number 1: BAT54CLT1GOSCT-ND
L?#7 = ACM9070: Supplier 1: Digi-Key; Supplier Part Number 1: 445-2216-1-ND
U?#6 = SIP2100: Supplier 1: Digi-Key; Supplier Part Number 1: SIP2100DY-T1-GE3CT-ND
X?#5 = MicroMatch4p: Supplier 1: Digi-Key; Supplier Part Number 1: A107022CT-ND

## Sheet BlockMesIp.SchDoc: <title>
size A4; Author: BKO + PKI; Organization: Institut d'Automatisation Industrielle; SheetNumber: 4; SheetTotal: 8; SVN: OUI; Version: 1.0.0; NoProject: N° SGX; ProjectTitle: Balance; CurrentTime: 6; CurrentDate: 5; DocumentFullPathAndName: 8; DocumentName: 9; ModifiedDate: 13; ProjectName: <projet>
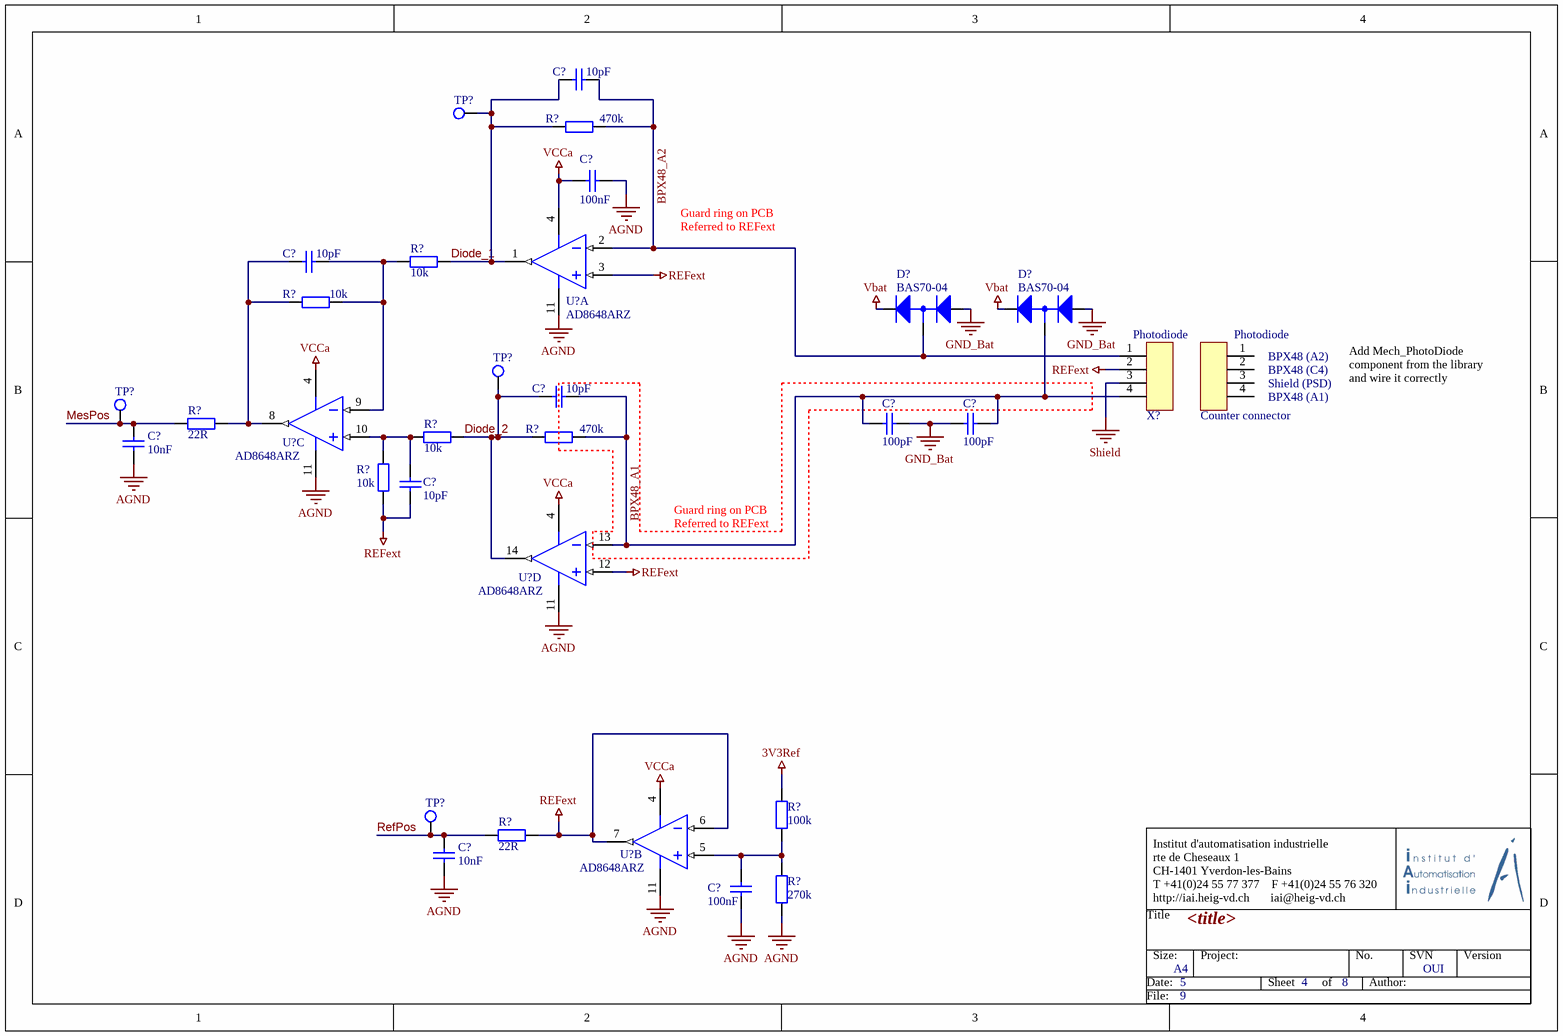
[diagram p5: BlockMesIp.SchDoc]

### Parts
(Parts that share a designator on the sheet are numbered #1, #2 ... from top to bottom, then left to right.)
C?#37  10pF  [CAPC2012N]
C?#38  100nF  [CAPC2012N]
C?#39  10pF  [CAPC2012N]
C?#40  10pF  [CAPC2012N]
C?#41  100pF  [CAPC2012N]
C?#42  100pF  [CAPC2012N]
C?#43  10nF  [CAPC2012N]
C?#44  10pF  [CAPC2012N]
C?#45  10nF  [CAPC2012N]
C?#46  100nF  [CAPC2012N]
D?#11  BAS70-04  [SOT23-3N]
D?#12  BAS70-04  [SOT23-3N]
R?#37  470k  [RESC2012N]
R?#38  10k  [RESC2012N]
R?#39  10k  [RESC2012N]
R?#40  22R  [RESC2012N]
R?#41  10k  [RESC2012N]
R?#42  470k  [RESC2012N]
R?#43  10k  [RESC2012N]
R?#44  22R  [RESC2012N]
R?#45  100k  [RESC2012N]
R?#46  270k  [RESC2012N]
TP?#20  TP  [Testpoint]  (value not drawn)
TP?#21  TP  [Testpoint]  (value not drawn)
TP?#22  TP  [Testpoint]  (value not drawn)
TP?#23  TP  [Testpoint]  (value not drawn)
U?#10  AD8648ARZ  [ADI-R-14_M]  (part A of 4)
U?#11  AD8648ARZ  [ADI-R-14_M]  (part C of 4)
U?#12  AD8648ARZ  [ADI-R-14_M]  (part D of 4)
U?#13  AD8648ARZ  [ADI-R-14_M]  (part B of 4)
X?#6  MicroMatch4p  [MicroMatch4p]  (value not drawn)
Y?#3  Counter connector  (no BOM)

### Nets
3V3Ref: R?#45.2
AGND: C?#38.1 C?#43.1 C?#45.1 C?#46.1 R?#46.1 U?#10.11(-V) U?#11.11(-V) U?#12.11(-V) U?#13.11(-V)
GND_Bat: C?#41.2 C?#42.1 D?#11.1(A) D?#12.1(A)
REFext: C?#44.1 R?#43.1 R?#44.2 U?#10.3(+IN_A) U?#12.12(+IN_D) U?#13.6(-IN_B) U?#13.7(OUT_B) X?#6.2
Shield: X?#6.3
Vbat: D?#11.2(K) D?#12.2(K)
VCCa: C?#38.2 U?#10.4(+V) U?#11.4(+V) U?#12.4(+V) U?#13.4(+V)
BPX48_A1: C?#40.2 C?#41.1 C?#42.2 D?#12.3(A/K) R?#42.2 U?#12.13(-IN_D) X?#6.4
BPX48_A2: C?#37.2 D?#11.3(A/K) R?#37.2 U?#10.2(-IN_A) X?#6.1
Diode_1: C?#37.1 R?#37.1 R?#38.2 TP?#20.1 U?#10.1(OUT_A)
Diode_2: C?#40.1 R?#41.2 R?#42.1 TP?#21.1 U?#12.14(OUT_D)
MesPos: C?#43.2 R?#40.1 TP?#22.1
RefPos: C?#45.2 R?#44.1 TP?#23.1
NetC?#39_1: C?#39.1 R?#39.1 R?#40.2 U?#11.8(OUT_C)
NetC?#39_2: C?#39.2 R?#38.1 R?#39.2 U?#11.9(-IN_C)
NetC?#44_2: C?#44.2 R?#41.1 R?#43.2 U?#11.10(+IN_C)
NetC?#46_2: C?#46.2 R?#45.1 R?#46.2 U?#13.5(+IN_B)

Not connected (* = marked no-connect by the designer): Y?#3 1 2 3 4

### Notes on the sheet
- Guard ring on PCB
- Referred to REFext
- (near X?#6) Photodiode
- (near Y?#3) Photodiode
- (near Y?#3) BPX48 (A2)
- (near Y?#3) BPX48 (C4)
- (near Y?#3) Shield (PSD)
- (near Y?#3) BPX48 (A1)
- Add Mech_PhotoDiode component from the library and wire it correctly
- Title
- Institut d'automatisation industrielle
  rte de Cheseaux 1
  CH-1401 Yverdon-les-Bains
  T +41(0)24 55 77 377    F +41(0)24 55 76 320
  http://iai.heig-vd.ch       iai@heig-vd.ch
- Date:
- Size:
- A4
- Project:
- Sheet
- of
- No.
- Author:
- SVN
- Version
- File:

### Library data of the parts
C?#37 C?#39 C?#40 C?#44 = Cap_10pF: Capacitor; Value: 10pF; Supplier 1: Digi-Key; Supplier Part Number 1: 311-1099-1-ND
C?#38 C?#46 = Cap_100nF: Capacitor; Value: 100nF; Supplier 1: Digi-Key; Supplier Part Number 1: 478-1395-1-ND
C?#41 C?#42 = Cap_100pF: Capacitor; Value: 100pF; Supplier 1: Digi-Key; Supplier Part Number 1: 399-1122-1-ND
C?#43 C?#45 = Cap_10nF: Capacitor; Value: 10nF; Supplier 1: Digi-Key; Supplier Part Number 1: 311-1136-1-ND
R?#37 R?#42 = Res_470k: Resistor; Value: 470k; Supplier 1: Digi-Key; Supplier Part Number 1: 311-470KCRCT-ND
R?#38 R?#39 R?#41 R?#43 = Res_10k: Resistor; Value: 10k; Supplier 1: Digi-Key; Supplier Part Number 1: 311-10.0KCRCT-ND
R?#40 R?#44 = Res_22R: Resistor; Value: 22R; Supplier 1: Digi-Key; Supplier Part Number 1: 311-22.0CRCT-ND
R?#45 = Res_100k: Resistor; Value: 100k; Supplier 1: Digi-Key; Supplier Part Number 1: 311-100KCRCT-ND
R?#46 = Res_270k: Resistor; Value: 270k; Supplier 1: Digi-Key; Supplier Part Number 1: 311-270KCRCT-ND
TP?#20-TP?#23 = TP: =Value; Supplier 1: Digi-Key; Supplier Part Number 1: 36-5006-ND
U?#10-U?#13 = AD8648ARZ: as U?#1 on sheet BlockPowerSupply; DatasheetVersion: Rev. D; PackageVersion: 060606-A; PackageReference: R-14; PackageDescription: 14-Pin Standard Small Outline Package, Body 8.65 x 3.9 mm, Pitch 1.27 mm; Mounting Technology: Surface Mount; Code_JEDEC: MS-012-AB; PartNumber: AD8648ARZ; ComponentLink1Description: Manufacturer URL; ComponentLink1URL: http://www.analog.com/en/index.html; ComponentLink2Description: Datasheet; ComponentLink2URL: http://www.analog.com/static/imported-files/data_sheets/AD8646_8647_8648.pdf; ComponentLink3Description: Package Specification; ComponentLink3URL: http://www.analog.com/static/imported-files/packages/PKG_PDF/SOIC_Narrow%20(R)/R_14.pdf; Supplier 1: Digi-Key; Supplier Part Number 1: AD8648ARZ-ND
Y?#3 = MicroMatch4p_Header: Counter connector of MicroMatch4p; Supplier 1: Digi-Key; Supplier Part Number 1: A107022CT-ND
D?#11 D?#12 = BAS70-04: Supplier 1: Digi-Key; Supplier Part Number 1: BAS70-04-FDICT-ND
X?#6 = MicroMatch4p: Supplier 1: Digi-Key; Supplier Part Number 1: A107022CT-ND

## Sheet BlockUIAffichage.SchDoc: <title>
size A4; Author: BKO + PKI; Organization: Institut d'Automatisation Industrielle; SheetNumber: 6; SheetTotal: 8; SVN: OUI; Version: 1.0.0; NoProject: N° SGX; ProjectTitle: Balance; CurrentTime: 6; CurrentDate: 5; DocumentFullPathAndName: 8; DocumentName: 9; ModifiedDate: 13; ProjectName: <projet>
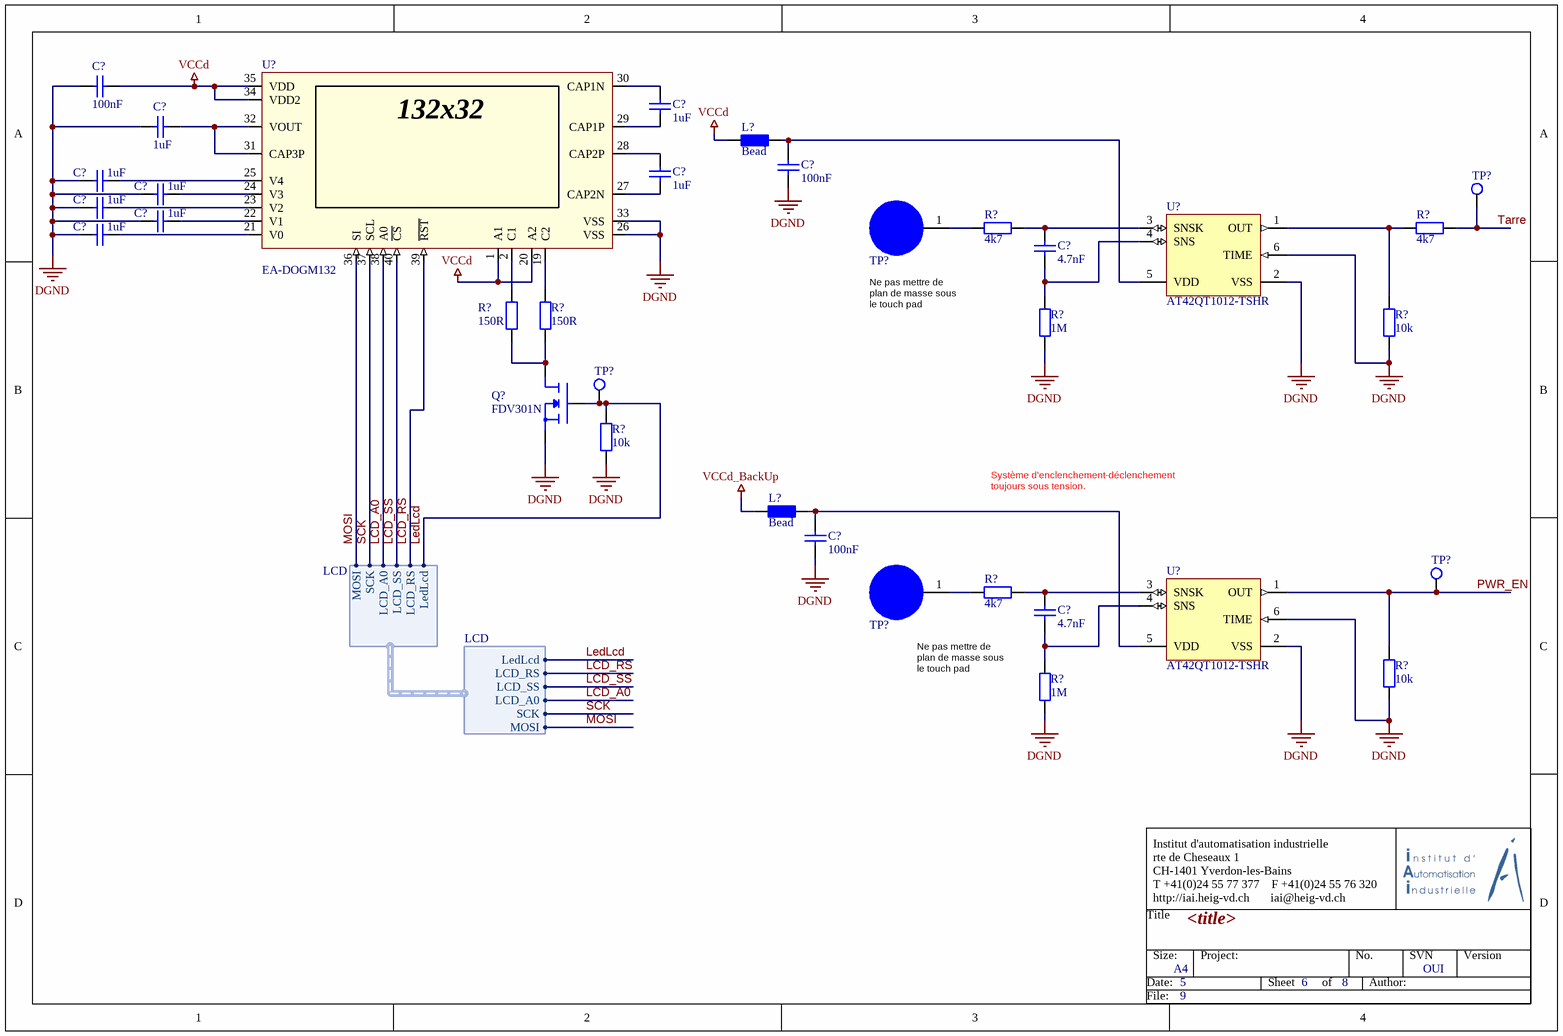
[diagram p6: BlockUIAffichage.SchDoc]

### Parts
(Parts that share a designator on the sheet are numbered #1, #2 ... from top to bottom, then left to right.)
C?#47  100nF  [CAPC2012N]
C?#48  1uF  [CAPC2012N]
C?#49  1uF  [CAPC2012N]
C?#50  1uF  [CAPC2012N]
C?#51  100nF  [CAPC2012N]
C?#52  1uF  [CAPC2012N]
C?#53  1uF  [CAPC2012N]
C?#54  1uF  [CAPC2012N]
C?#55  1uF  [CAPC2012N]
C?#56  1uF  [CAPC2012N]
C?#57  4.7nF  [CAPC2012N]
C?#58  100nF  [CAPC2012N]
C?#59  4.7nF  [CAPC2012N]
L?#9  Bead  [RESC2012N]
L?#10  Bead  [RESC2012N]
Q?#4  FDV301N  [SOT23-3N]
R?#47  4k7  [RESC2012N]
R?#48  4k7  [RESC2012N]
R?#49  150R  [RESC2012N]
R?#50  150R  [RESC2012N]
R?#51  1M  [RESC2012N]
R?#52  10k  [RESC2012N]
R?#53  10k  [RESC2012N]
R?#54  4k7  [RESC2012N]
R?#55  10k  [RESC2012N]
R?#56  1M  [RESC2012N]
TP?#24  TP  [Testpoint]  (value not drawn)
TP?#25  TouchPad10mm  [TouchPad10mm]  (value not drawn)
TP?#26  TP  [Testpoint]  (value not drawn)
TP?#27  TouchPad10mm  [TouchPad10mm]  (value not drawn)
TP?#28  TP  [Testpoint]  (value not drawn)
U?#14  AT42QT1012-TSHR  [SOT-23-6]
U?#15  EA-DOGM132  [EA_DOGM132_WITH_BACKLIGHT]
U?#16  AT42QT1012-TSHR  [SOT-23-6]

### Harnesses
LCD: LCD_RS, LCD_SS, MOSI, SCK, LedLcd, LCD_A0

### Nets
DGND: C?#47.1 C?#48.1 C?#50.1 C?#51.1 C?#52.1 C?#54.1 C?#55.1 C?#56.1 C?#58.1 Q?#4.2(S) R?#51.1 R?#52.1 R?#53.1 R?#55.1 R?#56.1 U?#14.2(VSS) U?#14.6(TIME) U?#15.26(VSS) U?#15.33(VSS) U?#16.2(VSS) U?#16.6(TIME)
VCCd: C?#47.2 L?#9.1 U?#15.1(A1) U?#15.20(A2) U?#15.34(VDD2) U?#15.35(VDD)
VCCd_BackUp: L?#10.1
LCD_A0: U?#15.38(A0) ; harness LCD.LCD_A0
LCD_RS: U?#15.39(~{RST}) ; harness LCD.LCD_RS
LCD_SS: U?#15.40(~{CS}) ; harness LCD.LCD_SS
LedLcd: Q?#4.1(G) R?#53.2 TP?#26.1 ; harness LCD.LedLcd
MOSI: U?#15.36(SI) ; harness LCD.MOSI
PWR_EN: R?#55.2 TP?#28.1 U?#16.1(OUT)
SCK: U?#15.37(SCL) ; harness LCD.SCK
Tarre: R?#48.2 TP?#24.1
NetC?#48_2: C?#48.2 U?#15.31(CAP3P) U?#15.32(VOUT)
NetC?#49_1: C?#49.1 U?#15.29(CAP1P)
NetC?#49_2: C?#49.2 U?#15.30(CAP1N)
NetC?#50_2: C?#50.2 U?#15.25(V4)
NetC?#51_2: C?#51.2 L?#9.2 U?#14.5(VDD)
NetC?#52_2: C?#52.2 U?#15.24(V3)
NetC?#53_1: C?#53.1 U?#15.27(CAP2N)
NetC?#53_2: C?#53.2 U?#15.28(CAP2P)
NetC?#54_2: C?#54.2 U?#15.23(V2)
NetC?#55_2: C?#55.2 U?#15.22(V1)
NetC?#56_2: C?#56.2 U?#15.21(V0)
NetC?#57_1: C?#57.1 R?#51.2 U?#14.4(SNS)
NetC?#57_2: C?#57.2 R?#47.2 U?#14.3(SNSK)
NetC?#58_2: C?#58.2 L?#10.2 U?#16.5(VDD)
NetC?#59_1: C?#59.1 R?#56.2 U?#16.4(SNS)
NetC?#59_2: C?#59.2 R?#54.2 U?#16.3(SNSK)
NetQ?#4_3: Q?#4.3(D) R?#49.1 R?#50.1
NetR?#47_1: R?#47.1 TP?#25.1
NetR?#48_1: R?#48.1 R?#52.2 U?#14.1(OUT)
NetR?#49_2: R?#49.2 U?#15.2(C1)
NetR?#50_2: R?#50.2 U?#15.19(C2)
NetR?#54_1: R?#54.1 TP?#27.1

### Notes on the sheet
- Ne pas mettre de
  plan de masse sous
  le touch pad
- Système d'enclenchement-déclenchement
  toujours sous tension.
- Title
- Institut d'automatisation industrielle
  rte de Cheseaux 1
  CH-1401 Yverdon-les-Bains
  T +41(0)24 55 77 377    F +41(0)24 55 76 320
  http://iai.heig-vd.ch       iai@heig-vd.ch
- Date:
- Size:
- A4
- Project:
- Sheet
- of
- No.
- Author:
- SVN
- Version
- File:
- (in symbol DOGM_132-5) 132x32

### Library data of the parts
C?#47 C?#51 C?#58 = Cap_100nF: Capacitor; Value: 100nF; Supplier 1: Digi-Key; Supplier Part Number 1: 478-1395-1-ND
C?#48-C?#50 C?#52-C?#56 = Cap_1uF: Capacitor; Value: 1uF; Supplier 1: Digi-Key; Supplier Part Number 1: 490-10743-1-ND
C?#57 C?#59 = Cap_4.7nF: Capacitor; Value: 4.7nF; Supplier 1: Digi-Key; Supplier Part Number 1: 311-1431-1-ND
R?#47 R?#48 R?#54 = Res_4k7: Resistor; Value: 4k7; Supplier 1: Digi-Key; Supplier Part Number 1: 311-4.70KCRCT-ND
R?#49 R?#50 = Res_150R: Resistor; Value: 150R; Supplier 1: Digi-Key; Supplier Part Number 1: 311-150CRCT-ND
R?#51 R?#56 = Res_1M: Resistor; Value: 1M; Supplier 1: Digi-Key; Supplier Part Number 1: 311-1.00MCRCT-ND
R?#52 R?#53 R?#55 = Res_10k: Resistor; Value: 10k; Supplier 1: Digi-Key; Supplier Part Number 1: 311-10.0KCRCT-ND
TP?#24 TP?#26 TP?#28 = TP: =Value; Supplier 1: Digi-Key; Supplier Part Number 1: 36-5006-ND
U?#14 U?#16 = AT42QT1012-TSHR: One-channel Toggle-mode Touch Sensor IC with Power Management Functions, -40° to +85° C, 6-pin SOT23; DatasheetVersion: revD, Aug-2010; PackageVersion: revA, Jun-2008; PackageReference: 6ST1; PackageDescription: 6-Lead, 2.90 x 1.60 mm Plastic Small Outline Package (SOT23); Code_JEDEC: MO-178-AB; Code_IPC: SOT26A-6; ComponentLink1Description: Manufacturer URL; ComponentLink1URL: http://www.atmel.com/; ComponentLink2Description: Datasheet; ComponentLink2URL: http://www.atmel.com/Images/doc9543.pdf; Supplier 1: Digi-Key; Supplier Part Number 1: AT42QT1012-TSHRCT-ND
U?#15 = DOGM_132-5: Chip On Glass Graphic LCD; Value: EA-DOGM132
L?#9 L?#10 = Bead: Value: Bead; Supplier 1: Digi-Key; Supplier Part Number 1: 240-2399-1-ND
Q?#4 = FDV301N: Value: FDV301N; Supplier 1: Digi-Key; Supplier Part Number 1: FDV301NCT-ND

## Sheet BlockController.SchDoc: <title>
size A3; Author: BKO + PKI; Organization: Institut d'Automatisation Industrielle; SheetNumber: 8; SheetTotal: 8; SVN: OUI; Version: 1.0.0; NoProject: N° SGX; ProjectTitle: Balance; CurrentTime: 6; CurrentDate: 5; DocumentFullPathAndName: 8; DocumentName: 9; ModifiedDate: 13; ProjectName: <projet>
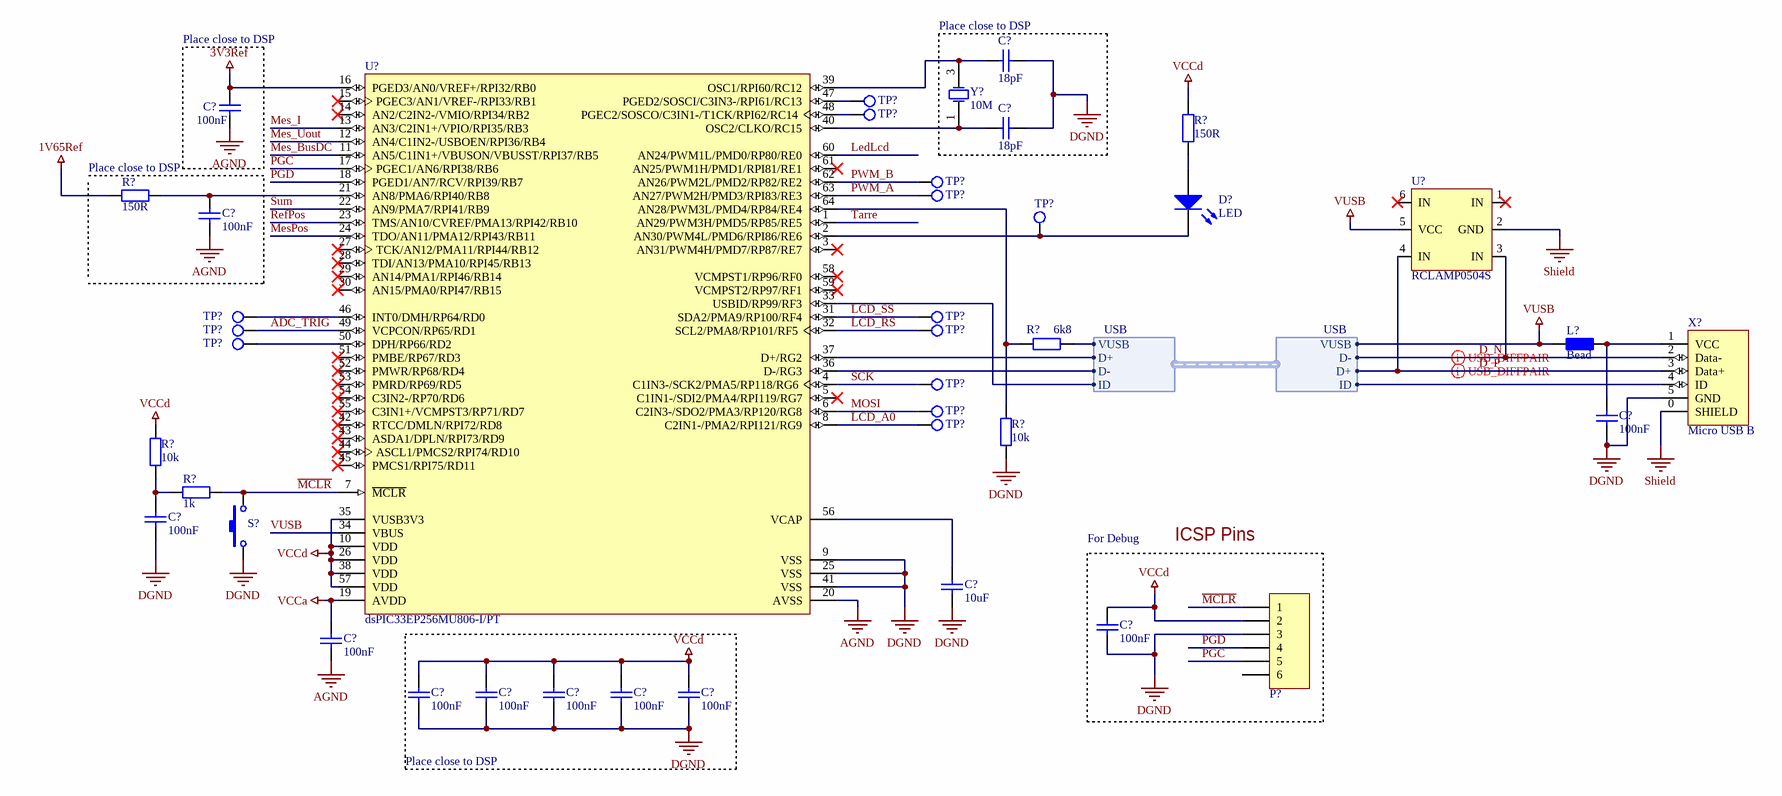
[diagram p7: BlockController.SchDoc]

### Parts
(Parts that share a designator on the sheet are numbered #1, #2 ... from top to bottom, then left to right.)
C?#60  18pF  [CAPC2012N]
C?#61  100nF  [CAPC2012N]
C?#62  18pF  [CAPC2012N]
C?#63  100nF  [CAPC2012N]
C?#64  100nF  [CAPC2012N]
C?#65  100nF  [CAPC2012N]
C?#66  10uF  [CAP1206]
C?#67  100nF  [CAPC2012N]
C?#68  100nF  [CAPC2012N]
C?#69  100nF  [CAPC2012N]
C?#70  100nF  [CAPC2012N]
C?#71  100nF  [CAPC2012N]
C?#72  100nF  [CAPC2012N]
C?#73  100nF  [CAPC2012N]
D?#13  LED  [LED2012N]
L?#11  Bead  [RESC2012N]
P?  Connector  [HEADER_6]  (value not drawn)
R?#57  150R  [RESC2012N]
R?#58  150R  [RESC2012N]
R?#59  6k8  [RESC2012N]
R?#60  10k  [RESC2012N]
R?#61  10k  [RESC2012N]
R?#62  1k  [RESC2012N]
S?  SW PTS810  [SW PTS810]  (value not drawn)
TP?#29  TP  [Testpoint]  (value not drawn)
TP?#30  TP  [Testpoint]  (value not drawn)
TP?#31  TP  [Testpoint]  (value not drawn)
TP?#32  TP  [Testpoint]  (value not drawn)
TP?#33  TP  [Testpoint]  (value not drawn)
TP?#34  TP  [Testpoint]  (value not drawn)
TP?#35  TP  [Testpoint]  (value not drawn)
TP?#36  TP  [Testpoint]  (value not drawn)
TP?#37  TP  [Testpoint]  (value not drawn)
TP?#38  TP  [Testpoint]  (value not drawn)
TP?#39  TP  [Testpoint]  (value not drawn)
TP?#40  TP  [Testpoint]  (value not drawn)
TP?#41  TP  [Testpoint]  (value not drawn)
U?#17  dsPIC33EP256MU806-I/PT  [TQFP64]
U?#18  RCLAMP0504S  [SOT-23-6]
X?#7  Micro USB B  [Micro_USB_ZX62-B-5PA(33)]
Y?#4  value 10M  [CRYSTAL_ABMM]  (hidden comment: XTAL)

### Blocks framed on the sheet
Place close to DSP: C?#60 C?#62 Y?#4
Place close to DSP: C?#61
ICSP Pins: C?#67 P?

### Harnesses
USB: VUSB, D-, D+, ID

### Nets
1V65Ref: R?#58.1
3V3Ref: C?#61.2 U?#17.16(PGED3/AN0/VREF+/RPI32/RB0)
AGND: C?#61.1 C?#63.1 C?#68.1 U?#17.20(AVSS)
DGND: C?#60.2 C?#62.2 C?#64.1 C?#65.1 C?#66.1 C?#67.1 C?#69.1 C?#70.1 C?#71.1 C?#72.1 C?#73.1 P?.3 R?#60.1 S?.1 U?#17.9(VSS) U?#17.25(VSS) U?#17.41(VSS) X?#7.5(GND)
Shield: U?#18.2(GND) X?#7.0(SHIELD)
VCCa: C?#68.2 U?#17.19(AVDD)
VCCd: C?#67.2 C?#69.2 C?#70.2 C?#71.2 C?#72.2 C?#73.2 P?.2 R?#57.2 R?#61.2 U?#17.10(VDD) U?#17.26(VDD) U?#17.35(VUSB3V3) U?#17.38(VDD) U?#17.57(VDD)
VUSB: L?#11.2 R?#59.2 U?#17.34(VBUS) U?#18.5(VCC) ; harness USB.VUSB
~{MCLR}: P?.1 R?#62.2 S?.3 U?#17.7(~{MCLR})
ADC_TRIG: TP?#36.1 U?#17.49(VCPCON/RP65/RD1)
D_N: U?#17.36(D-/RG3) U?#18.3(IN) X?#7.2(Data-) ; harness USB.D-
D_P: U?#17.37(D+/RG2) U?#18.4(IN) X?#7.3(Data+) ; harness USB.D+
LCD_A0: TP?#41.1 U?#17.8(C2IN1-/PMA2/RPI121/RG9)
LCD_RS: TP?#37.1 U?#17.32(SCL2/PMA8/RP101/RF5)
LCD_SS: TP?#35.1 U?#17.31(SDA2/PMA9/RP100/RF4)
LedLcd: U?#17.60(AN24/PWM1L/PMD0/RP80/RE0)
Mes_BusDC: U?#17.11(AN5/C1IN1+/VBUSON/VBUSST/RPI37/RB5)
Mes_I: U?#17.13(AN3/C2IN1+/VPIO/RPI35/RB3)
Mes_Uout: U?#17.12(AN4/C1IN2-/USBOEN/RPI36/RB4)
MesPos: U?#17.24(TDO/AN11/PMA12/RPI43/RB11)
MOSI: TP?#40.1 U?#17.6(C2IN3-/SDO2/PMA3/RP120/RG8)
PGC: P?.5 U?#17.17(PGEC1/AN6/RPI38/RB6)
PGD: P?.4 U?#17.18(PGED1/AN7/RCV/RPI39/RB7)
PWM_A: TP?#32.1 U?#17.63(AN27/PWM2H/PMD3/RPI83/RE3)
PWM_B: TP?#31.1 U?#17.62(AN26/PWM2L/PMD2/RP82/RE2)
RefPos: U?#17.23(TMS/AN10/CVREF/PMA13/RPI42/RB10)
SCK: TP?#39.1 U?#17.4(C1IN3-/SCK2/PMA5/RP118/RG6)
Sum: U?#17.22(AN9/PMA7/RPI41/RB9)
Tarre: U?#17.1(AN29/PWM3H/PMD5/RP85/RE5)
NetC?#60_1: C?#60.1 U?#17.39(OSC1/RPI60/RC12) Y?#4.3(OSC2)
NetC?#62_1: C?#62.1 U?#17.40(OSC2/CLKO/RC15) Y?#4.1(OSC1)
NetC?#63_2: C?#63.2 R?#58.2 U?#17.21(AN8/PMA6/RPI40/RB8)
NetC?#64_2: C?#64.2 L?#11.1 X?#7.1(VCC)
NetC?#65_2: C?#65.2 R?#61.1 R?#62.1
NetC?#66_2: C?#66.2 U?#17.56(VCAP)
NetD?#13_1: D?#13.1(A) R?#57.1
NetD?#13_2: D?#13.2(K) TP?#33.1 U?#17.2(AN30/PWM4L/PMD6/RPI86/RE6)
NetR?#59_1: R?#59.1 R?#60.2 U?#17.64(AN28/PWM3L/PMD4/RP84/RE4)
NetTP?#29_1: TP?#29.1 U?#17.47(PGED2/SOSCI/C3IN3-/RPI61/RC13)
NetTP?#30_1: TP?#30.1 U?#17.48(PGEC2/SOSCO/C3IN1-/T1CK/RPI62/RC14)
NetTP?#34_1: TP?#34.1 U?#17.46(INT0/DMH/RP64/RD0)
NetTP?#38_1: TP?#38.1 U?#17.50(DPH/RP66/RD2)
NetU?#17_33: U?#17.33(USBID/RP99/RF3) X?#7.4(ID) ; harness USB.ID

Not connected (* = marked no-connect by the designer): P? 6; U?#17 3(AN31/PWM4H/PMD7/RP87/RE7)* 5(C1IN1-/SDI2/PMA4/RPI119/RG7)* 14(AN2/C2IN2-/VMIO/RPI34/RB2)* 15(PGEC3/AN1/VREF-/RPI33/RB1)* 27(TCK/AN12/PMA11/RPI44/RB12)* 28(TDI/AN13/PMA10/RPI45/RB13)* 29(AN14/PMA1/RPI46/RB14)* 30(AN15/PMA0/RPI47/RB15)* 42(RTCC/DMLN/RPI72/RD8)* 43(ASDA1/DPLN/RPI73/RD9)* 44(ASCL1/PMCS2/RPI74/RD10)* 45(PMCS1/RPI75/RD11)* 51(PMBE/RP67/RD3)* 52(PMWR/RP68/RD4)* 53(PMRD/RP69/RD5)* 54(C3IN2-/RP70/RD6)* 55(C3IN1+/VCMPST3/RP71/RD7)* 58(VCMPST1/RP96/RF0)* 59(VCMPST2/RP97/RF1)* 61(AN25/PWM1H/PMD1/RPI81/RE1)*; U?#18 1(IN)* 6(IN)*

### Layout directives
differential pair: D_N, D_P

### Notes on the sheet
- (near R?#58) Place close to DSP
- For Debug
- Place close to DSP
- Title
- Institut d'automatisation industrielle
  rte de Cheseaux 1
  CH-1401 Yverdon-les-Bains
  T +41(0)24 55 77 377    F +41(0)24 55 76 320
  http://iai.heig-vd.ch       iai@heig-vd.ch
- Date:
- Size:
- A3
- Project:
- Sheet
- of
- No.
- Author:
- SVN
- Version
- File:

### Library data of the parts
C?#60 C?#62 = Cap_18pF: Capacitor; Value: 18pF; Supplier 1: Digi-Key; Supplier Part Number 1: 311-1102-1-ND
C?#61 C?#63-C?#65 C?#67-C?#73 = Cap_100nF: Capacitor; Value: 100nF; Supplier 1: Digi-Key; Supplier Part Number 1: 478-1395-1-ND
C?#66 = Cap_10uF: Capacitor; Value: 10uF; Supplier 1: Digi-Key; Supplier Part Number 1: 445-7886-1-ND
D?#13 = Led_Rouge_0805: Supplier 1: Digi-Key; Supplier Part Number 1: 475-1415-1-ND
P? = Header 6: Header, 6-Pin; Supplier Part Number 1: S9015E-03-ND; Supplier 1: Digi-Key
R?#57 R?#58 = Res_150R: Resistor; Value: 150R; Supplier 1: Digi-Key; Supplier Part Number 1: 311-150CRCT-ND
R?#59 = Res_6k8: Resistor; Value: 6k8; Supplier 1: Digi-Key; Supplier Part Number 1: 311-6.80KCRCT-ND
R?#60 R?#61 = Res_10k: Resistor; Value: 10k; Supplier 1: Digi-Key; Supplier Part Number 1: 311-10.0KCRCT-ND
R?#62 = Res__1k: Resistor; Value: 1k; Supplier 1: Digi-Key; Supplier Part Number 1: 311-1.00KCRCT-ND
S? = SW PTS810: Switch; Supplier 1: Digi-Key; Supplier Part Number 1: CKN10502CT-ND
TP?#29-TP?#41 = TP: =Value; Supplier 1: Digi-Key; Supplier Part Number 1: 36-5006-ND
U?#17 = dsPIC33EP256MU806-I/PT: 16-Bit Digital Signal Processor; Supplier 1: Digi-Key; Supplier Part Number 1: DSPIC33EP256MU806-I/PT-ND; Value: DSPIC33EP256MU806-I/PT
U?#18 = RCLAMP0504S.TCT: Supplier 1: Digi-Key; Supplier Part Number 1: RCLAMP0504SCT-ND
X?#7 = Micro_USB_ZX62-B-5PA(33): Supplier 1: Digi-Key; Supplier Part Number 1: H125270CT-ND
Y?#4 = XTAL: Crystal Oscillator; Supplier 1: Digi-Key; Supplier Part Number 1: 535-9150-1-ND
L?#11 = Bead: Value: Bead; Supplier 1: Digi-Key; Supplier Part Number 1: 240-2399-1-ND

## Nets that join several sheets
1V65Ref: BlockPowerSupply (TP?#1.1 U?#1.8 U?#1.9), BlockAmpli_Mot (C?#31.1 C?#36.1 R?#26.1 R?#36.1), BlockController (R?#58.1)
3V3Ref: BlockPowerSupply (C?#14.2 R?#1.2 TP?#9.1 U?#4.5), BlockMesIp (R?#45.2), BlockController (C?#61.2 U?#17.16)
AGND: BlockPowerSupply (9 pins), BlockAmpli_LED (5 pins), BlockAmpli_Mot (9 pins), BlockMesIp (9 pins), BlockController (C?#61.1 C?#63.1 C?#68.1 U?#17.20)
BusDC: BlockPowerSupply (C?#3.2 Q?#1.3 TP?#2.1), BlockAmpli_Mot (C?#20.2 C?#21.2 R?#30.2 U?#6.3)
DGND: BlockPowerSupply (15 pins), BlockUIAffichage (21 pins), BlockController (18 pins)
GND_Bat: BlockPowerSupply (11 pins), BlockAmpli_LED (C?#17.2 C?#18.1 D?#4.1 D?#5.1), BlockAmpli_Mot (10 pins), BlockMesIp (C?#41.2 C?#42.1 D?#11.1 D?#12.1)
REFext: BlockAmpli_LED (R?#13.2), BlockMesIp (8 pins)
Shield: Main_PCB (5 pins), BlockPowerSupply (5 pins), BlockAmpli_LED (X?#4.2 X?#4.4), BlockAmpli_Mot (C?#24.2 C?#25.1 X?#5.2 X?#5.4), BlockMesIp (X?#6.3), BlockController (U?#18.2 X?#7.0)
Vbat: BlockPowerSupply (10 pins), BlockAmpli_LED (D?#4.2 D?#5.2), BlockAmpli_Mot (D?#6.2 D?#7.2), BlockMesIp (D?#11.2 D?#12.2)
VCCa: BlockPowerSupply (C?#10.2 L?#4.2 TP?#5.1 U?#1.4), BlockAmpli_LED (C?#19.2 R?#12.2 U?#5.7), BlockAmpli_Mot (7 pins), BlockMesIp (5 pins), BlockController (C?#68.2 U?#17.19)
VCCd: BlockPowerSupply (5 pins), BlockUIAffichage (6 pins), BlockController (14 pins)
VCCd_BackUp: BlockPowerSupply (C?#5.2 TP?#3.1 U?#2.5), BlockUIAffichage (L?#10.1)